# EAGLE design registers (EAGLE 5.11)

## Sheet 1 of 3
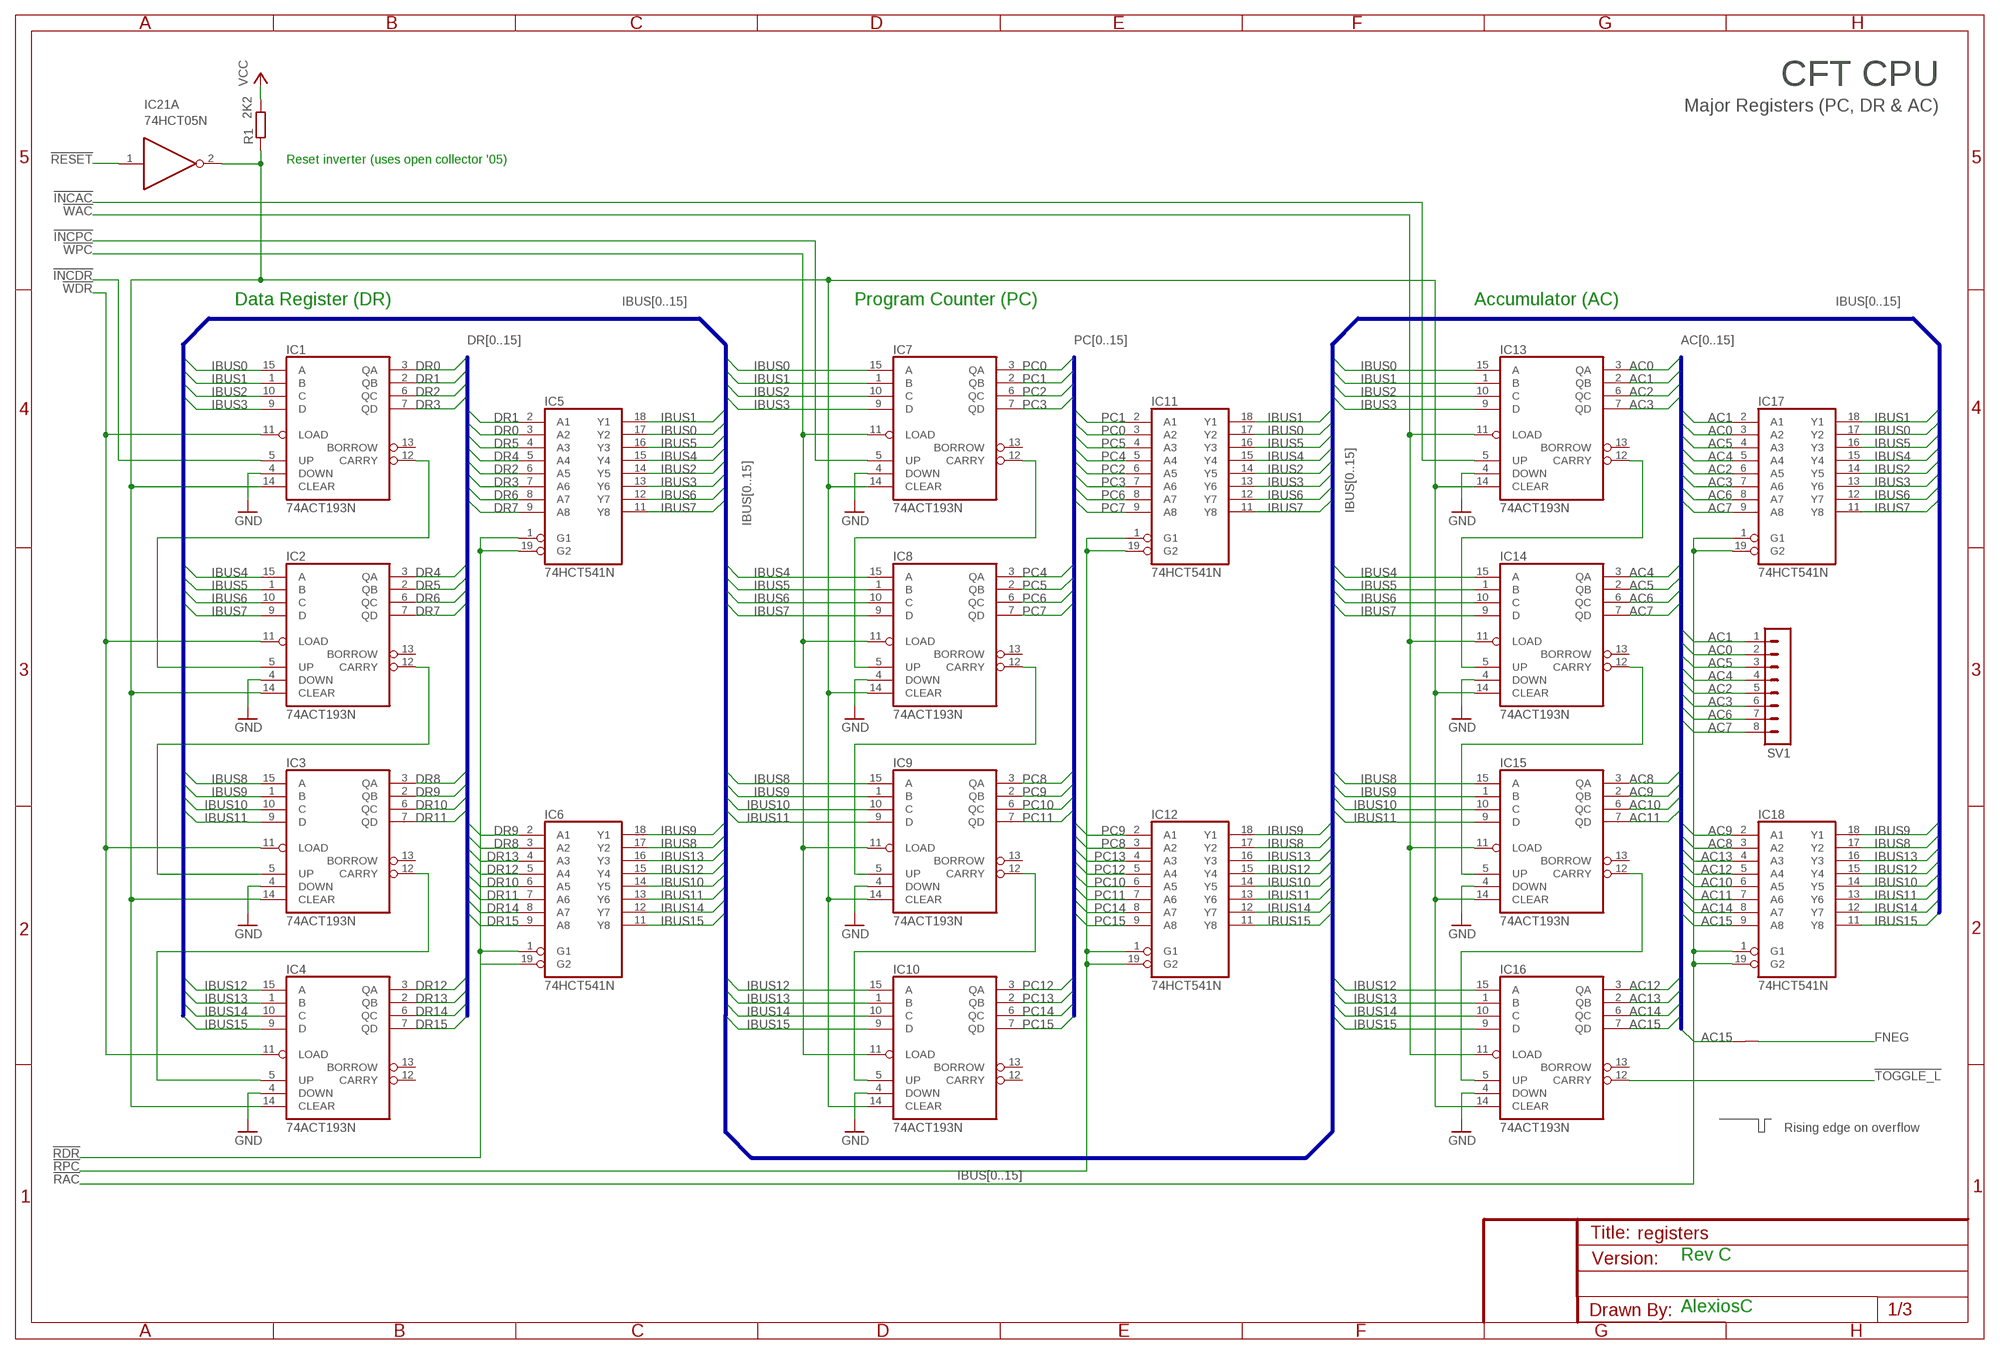
[diagram p0: schematic, sheet 1]

### Parts
IC1  74ACT193N  [DIL16]
IC2  74ACT193N  [DIL16]
IC3  74ACT193N  [DIL16]
IC4  74ACT193N  [DIL16]
IC5  74HCT541N  [DIL20]
IC6  74HCT541N  [DIL20]
IC7  74ACT193N  [DIL16]
IC8  74ACT193N  [DIL16]
IC9  74ACT193N  [DIL16]
IC10  74ACT193N  [DIL16]
IC11  74HCT541N  [DIL20]
IC12  74HCT541N  [DIL20]
IC13  74ACT193N  [DIL16]
IC14  74ACT193N  [DIL16]
IC15  74ACT193N  [DIL16]
IC16  74ACT193N  [DIL16]
IC17  74HCT541N  [DIL20]
IC18  74HCT541N  [DIL20]
IC21  74HCT05N  [DIL14]
J1  2SIG  [2SIG]
R1  2K2  R-EU_0204/7  [0204/7]
SV1  MA08-1  [MA08-1]

### Nets
!INCAC: IC13.5(UP) ; also sheet 3
!INCDR: IC1.5(UP) ; also sheet 3
!INCPC: IC7.5(UP) ; also sheet 3
!RAC: IC17.1(G1) IC17.19(G2) IC18.1(G1) IC18.19(G2) ; also sheet 3
!RDR: IC5.1(G1) IC5.19(G2) IC6.1(G1) IC6.19(G2) ; also sheet 3
!RESET: IC21.1(A:I) ; also sheet 3
!RPC: IC11.1(G1) IC11.19(G2) IC12.1(G1) IC12.19(G2) ; also sheet 3
!TOGGLE_L: IC16.12(CARRY) ; also sheet 2
!WAC: IC13.11(LOAD) IC14.11(LOAD) IC15.11(LOAD) IC16.11(LOAD) ; also sheet 3
!WDR: IC1.11(LOAD) IC2.11(LOAD) IC3.11(LOAD) IC4.11(LOAD) ; also sheet 3
!WPC: IC7.11(LOAD) IC8.11(LOAD) IC9.11(LOAD) IC10.11(LOAD) ; also sheet 3
AC0: IC13.3(QA) IC17.3(A2) SV1.2 ; also sheet 2
AC1: IC13.2(QB) IC17.2(A1) SV1.1 ; also sheet 2
AC2: IC13.6(QC) IC17.6(A5) SV1.5 ; also sheet 2
AC3: IC13.7(QD) IC17.7(A6) SV1.6 ; also sheet 2
AC4: IC14.3(QA) IC17.5(A4) SV1.4 ; also sheet 2
AC5: IC14.2(QB) IC17.4(A3) SV1.3 ; also sheet 2
AC6: IC14.6(QC) IC17.8(A7) SV1.7 ; also sheet 2
AC7: IC14.7(QD) IC17.9(A8) SV1.8 ; also sheet 2
AC8: IC15.3(QA) IC18.3(A2) ; also sheet 2
AC9: IC15.2(QB) IC18.2(A1) ; also sheet 2
AC10: IC15.6(QC) IC18.6(A5) ; also sheet 2
AC11: IC15.7(QD) IC18.7(A6) ; also sheet 2
AC12: IC16.3(QA) IC18.5(A4) ; also sheet 2
AC13: IC16.2(QB) IC18.4(A3) ; also sheet 2
AC14: IC16.6(QC) IC18.8(A7) ; also sheet 2
AC15: IC16.7(QD) IC18.9(A8) J1.P$1(B) ; also sheet 2
DR0: IC1.3(QA) IC5.3(A2)
DR1: IC1.2(QB) IC5.2(A1)
DR2: IC1.6(QC) IC5.6(A5)
DR3: IC1.7(QD) IC5.7(A6)
DR4: IC2.3(QA) IC5.5(A4)
DR5: IC2.2(QB) IC5.4(A3)
DR6: IC2.6(QC) IC5.8(A7)
DR7: IC2.7(QD) IC5.9(A8)
DR8: IC3.3(QA) IC6.3(A2)
DR9: IC3.2(QB) IC6.2(A1)
DR10: IC3.6(QC) IC6.6(A5)
DR11: IC3.7(QD) IC6.7(A6)
DR12: IC4.3(QA) IC6.5(A4)
DR13: IC4.2(QB) IC6.4(A3)
DR14: IC4.6(QC) IC6.8(A7)
DR15: IC4.7(QD) IC6.9(A8)
FNEG: J1.P$2(A) ; also sheet 3
GND [Power]: IC1.4(DOWN) IC2.4(DOWN) IC3.4(DOWN) IC4.4(DOWN) IC7.4(DOWN) IC8.4(DOWN) IC9.4(DOWN) IC10.4(DOWN) IC13.4(DOWN) IC14.4(DOWN) IC15.4(DOWN) IC16.4(DOWN) ; also sheet 2,3
IBUS0: IC1.15(A) IC5.17(Y2) IC7.15(A) IC11.17(Y2) IC13.15(A) IC17.17(Y2) ; also sheet 3
IBUS1: IC1.1(B) IC5.18(Y1) IC7.1(B) IC11.18(Y1) IC13.1(B) IC17.18(Y1) ; also sheet 3
IBUS2: IC1.10(C) IC5.14(Y5) IC7.10(C) IC11.14(Y5) IC13.10(C) IC17.14(Y5) ; also sheet 3
IBUS3: IC1.9(D) IC5.13(Y6) IC7.9(D) IC11.13(Y6) IC13.9(D) IC17.13(Y6) ; also sheet 3
IBUS4: IC2.15(A) IC5.15(Y4) IC8.15(A) IC11.15(Y4) IC14.15(A) IC17.15(Y4) ; also sheet 3
IBUS5: IC2.1(B) IC5.16(Y3) IC8.1(B) IC11.16(Y3) IC14.1(B) IC17.16(Y3) ; also sheet 3
IBUS6: IC2.10(C) IC5.12(Y7) IC8.10(C) IC11.12(Y7) IC14.10(C) IC17.12(Y7) ; also sheet 3
IBUS7: IC2.9(D) IC5.11(Y8) IC8.9(D) IC11.11(Y8) IC14.9(D) IC17.11(Y8) ; also sheet 3
IBUS8: IC3.15(A) IC6.17(Y2) IC9.15(A) IC12.17(Y2) IC15.15(A) IC18.17(Y2) ; also sheet 3
IBUS9: IC3.1(B) IC6.18(Y1) IC9.1(B) IC12.18(Y1) IC15.1(B) IC18.18(Y1) ; also sheet 3
IBUS10: IC3.10(C) IC6.14(Y5) IC9.10(C) IC12.14(Y5) IC15.10(C) IC18.14(Y5) ; also sheet 3
IBUS11: IC3.9(D) IC6.13(Y6) IC9.9(D) IC12.13(Y6) IC15.9(D) IC18.13(Y6) ; also sheet 3
IBUS12: IC4.15(A) IC6.15(Y4) IC10.15(A) IC12.15(Y4) IC16.15(A) IC18.15(Y4) ; also sheet 3
IBUS13: IC4.1(B) IC6.16(Y3) IC10.1(B) IC12.16(Y3) IC16.1(B) IC18.16(Y3) ; also sheet 3
IBUS14: IC4.10(C) IC6.12(Y7) IC10.10(C) IC12.12(Y7) IC16.10(C) IC18.12(Y7) ; also sheet 3
IBUS15: IC4.9(D) IC6.11(Y8) IC10.9(D) IC12.11(Y8) IC16.9(D) IC18.11(Y8) ; also sheet 3
N$25: IC1.12(CARRY) IC2.5(UP)
N$26: IC13.12(CARRY) IC14.5(UP)
N$27: IC14.12(CARRY) IC15.5(UP)
N$28: IC7.12(CARRY) IC8.5(UP)
N$29: IC2.12(CARRY) IC3.5(UP)
N$30: IC8.12(CARRY) IC9.5(UP)
N$31: IC3.12(CARRY) IC4.5(UP)
N$39: IC9.12(CARRY) IC10.5(UP)
N$77: IC15.12(CARRY) IC16.5(UP)
PC0: IC7.3(QA) IC11.3(A2)
PC1: IC7.2(QB) IC11.2(A1)
PC2: IC7.6(QC) IC11.6(A5)
PC3: IC7.7(QD) IC11.7(A6)
PC4: IC8.3(QA) IC11.5(A4)
PC5: IC8.2(QB) IC11.4(A3)
PC6: IC8.6(QC) IC11.8(A7)
PC7: IC8.7(QD) IC11.9(A8)
PC8: IC9.3(QA) IC12.3(A2)
PC9: IC9.2(QB) IC12.2(A1)
PC10: IC9.6(QC) IC12.6(A5) ; also sheet 3
PC11: IC9.7(QD) IC12.7(A6) ; also sheet 3
PC12: IC10.3(QA) IC12.5(A4) ; also sheet 3
PC13: IC10.2(QB) IC12.4(A3) ; also sheet 3
PC14: IC10.6(QC) IC12.8(A7) ; also sheet 3
PC15: IC10.7(QD) IC12.9(A8) ; also sheet 3
RESET: IC1.14(CLEAR) IC2.14(CLEAR) IC3.14(CLEAR) IC4.14(CLEAR) IC7.14(CLEAR) IC8.14(CLEAR) IC9.14(CLEAR) IC10.14(CLEAR) IC13.14(CLEAR) IC14.14(CLEAR) IC15.14(CLEAR) IC16.14(CLEAR) IC21.2(A:O) R1.1
VCC [Power]: R1.2 ; also sheet 2,3
Unconnected: IC1.13(BORROW) IC2.13(BORROW) IC3.13(BORROW) IC4.12(CARRY) IC4.13(BORROW) IC7.13(BORROW) IC8.13(BORROW) IC9.13(BORROW) IC10.12(CARRY) IC10.13(BORROW) IC13.13(BORROW) IC14.13(BORROW) IC15.13(BORROW) IC16.13(BORROW)

### Buses
IBUS[0..15]
DR[0..15]
PC[0..15]
AC[0..15]

### Notes on the sheet
- CFT CPU
- Major Registers (PC, DR & AC)
- Reset inverter (uses open collector '05)
- Data Register (DR) | Program Counter (PC) | Accumulator (AC)
- Rising edge on overflow
- Rev C
- AlexiosC

## Sheet 2 of 3
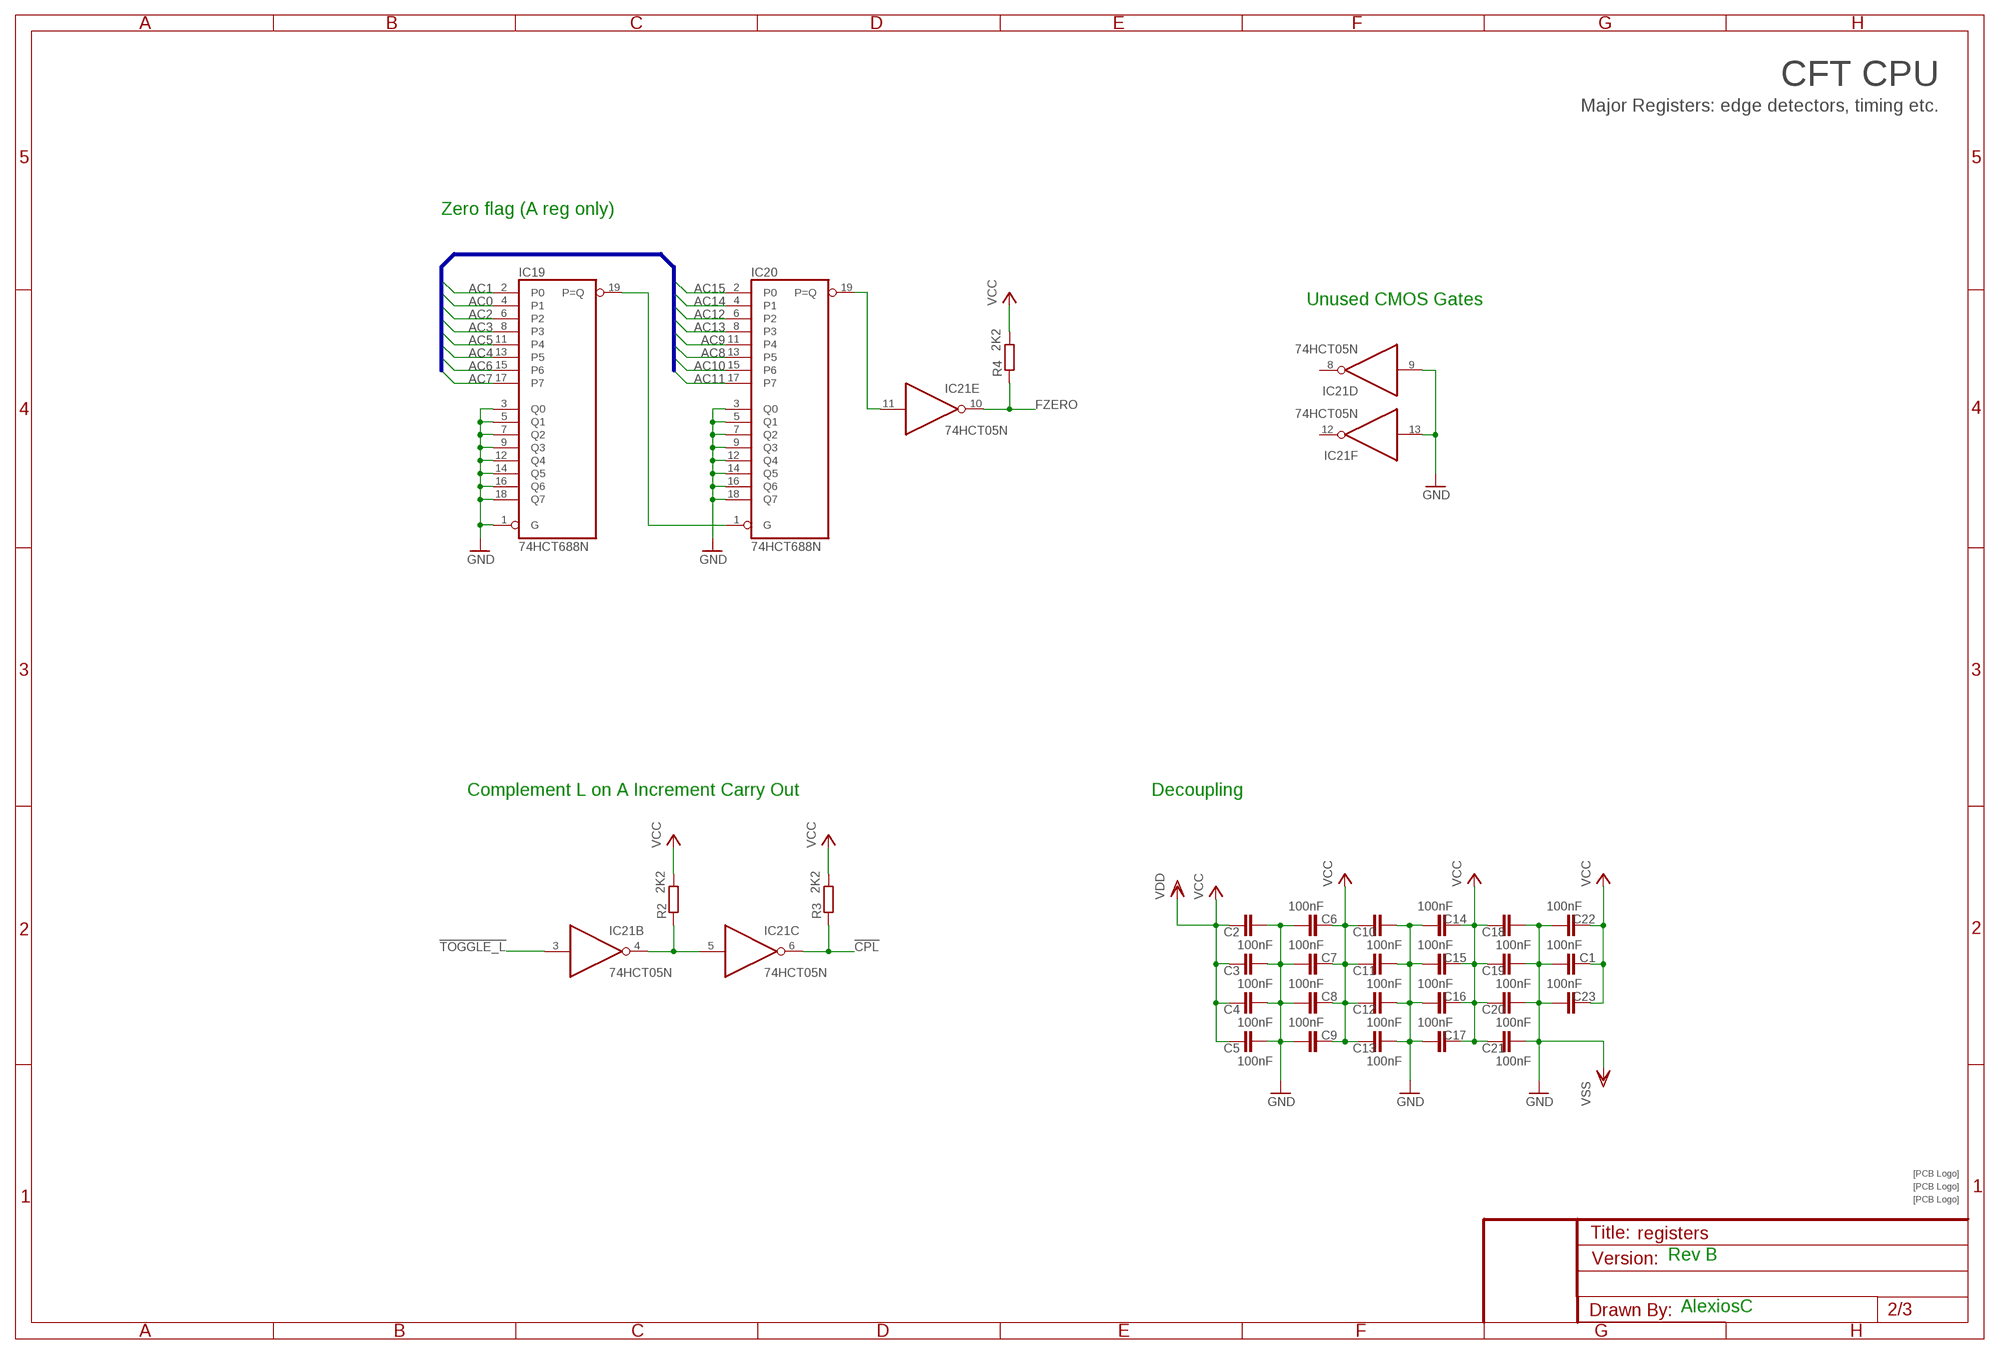
[diagram p1: schematic, sheet 2]

### Parts
C1  100nF  C-EU025-025X050  [C025-025X050]
C2  100nF  C-EU025-025X050  [C025-025X050]
C3  100nF  C-EU025-025X050  [C025-025X050]
C4  100nF  C-EU025-025X050  [C025-025X050]
C5  100nF  C-EU025-025X050  [C025-025X050]
C6  100nF  C-EU025-025X050  [C025-025X050]
C7  100nF  C-EU025-025X050  [C025-025X050]
C8  100nF  C-EU025-025X050  [C025-025X050]
C9  100nF  C-EU025-025X050  [C025-025X050]
C10  100nF  C-EU025-025X050  [C025-025X050]
C11  100nF  C-EU025-025X050  [C025-025X050]
C12  100nF  C-EU025-025X050  [C025-025X050]
C13  100nF  C-EU025-025X050  [C025-025X050]
C14  100nF  C-EU025-025X050  [C025-025X050]
C15  100nF  C-EU025-025X050  [C025-025X050]
C16  100nF  C-EU025-025X050  [C025-025X050]
C17  100nF  C-EU025-025X050  [C025-025X050]
C18  100nF  C-EU025-025X050  [C025-025X050]
C19  100nF  C-EU025-025X050  [C025-025X050]
C20  100nF  C-EU025-025X050  [C025-025X050]
C21  100nF  C-EU025-025X050  [C025-025X050]
C22  100nF  C-EU025-025X050  [C025-025X050]
C23  100nF  C-EU025-025X050  [C025-025X050]
IC19  74HCT688N  [DIL20]
IC20  74HCT688N  [DIL20]
R2  2K2  R-EU_0204/7  [0204/7]
R3  2K2  R-EU_0204/7  [0204/7]
R4  2K2  R-EU_0204/7  [0204/7]
U$4  SIGNATUREPLANE  [SIGNATURE_PLANE]
U$5  SIGNATUREPLANE  [SIGNATURE_PLANE]
U$6  SIGNATURESILK  [SIGNATURE]

### Nets
!CPL: IC21.6(C:O) R3.1 ; also sheet 3
!TOGGLE_L: IC21.3(B:I) ; also sheet 1
AC0: IC19.4(P1) ; also sheet 1
AC1: IC19.2(P0) ; also sheet 1
AC2: IC19.6(P2) ; also sheet 1
AC3: IC19.8(P3) ; also sheet 1
AC4: IC19.13(P5) ; also sheet 1
AC5: IC19.11(P4) ; also sheet 1
AC6: IC19.15(P6) ; also sheet 1
AC7: IC19.17(P7) ; also sheet 1
AC8: IC20.13(P5) ; also sheet 1
AC9: IC20.11(P4) ; also sheet 1
AC10: IC20.15(P6) ; also sheet 1
AC11: IC20.17(P7) ; also sheet 1
AC12: IC20.6(P2) ; also sheet 1
AC13: IC20.8(P3) ; also sheet 1
AC14: IC20.4(P1) ; also sheet 1
AC15: IC20.2(P0) ; also sheet 1
FZERO: IC21.10(E:O) R4.1 ; also sheet 3
GND [Power]: C1.1 C2.1 C3.1 C4.1 C5.1 C6.1 C7.1 C8.1 C9.1 C10.1 C11.1 C12.1 C13.1 C14.1 C15.1 C16.1 C17.1 C18.1 C19.1 C20.1 C21.1 C22.1 C23.1 IC19.1(G) IC19.3(Q0) IC19.5(Q1) IC19.7(Q2) IC19.9(Q3) IC19.12(Q4) IC19.14(Q5) IC19.16(Q6) IC19.18(Q7) IC20.3(Q0) IC20.5(Q1) IC20.7(Q2) IC20.9(Q3) IC20.12(Q4) IC20.14(Q5) IC20.16(Q6) IC20.18(Q7) IC21.9(D:I) IC21.13(F:I) ; supply symbol labelled VSS ; also sheet 1,3
N$1: IC21.4(B:O) IC21.5(C:I) R2.1
N$2: IC19.19(P=Q) IC20.1(G)
N$16: IC20.19(P=Q) IC21.11(E:I)
VCC [Power]: C1.2 C2.2 C3.2 C4.2 C5.2 C6.2 C7.2 C8.2 C9.2 C10.2 C11.2 C12.2 C13.2 C14.2 C15.2 C16.2 C17.2 C18.2 C19.2 C20.2 C21.2 C22.2 C23.2 R2.2 R3.2 R4.2 ; supply symbol labelled VDD ; also sheet 1,3
Unconnected: IC21.8(D:O) IC21.12(F:O)

### Buses
AC[0..15]

### Notes on the sheet
- CFT CPU
- Major Registers: edge detectors, timing etc.
- Zero flag (A reg only)
- Unused CMOS Gates
- Complement L on A Increment Carry Out | Decoupling
- Rev B
- AlexiosC

## Sheet 3 of 3
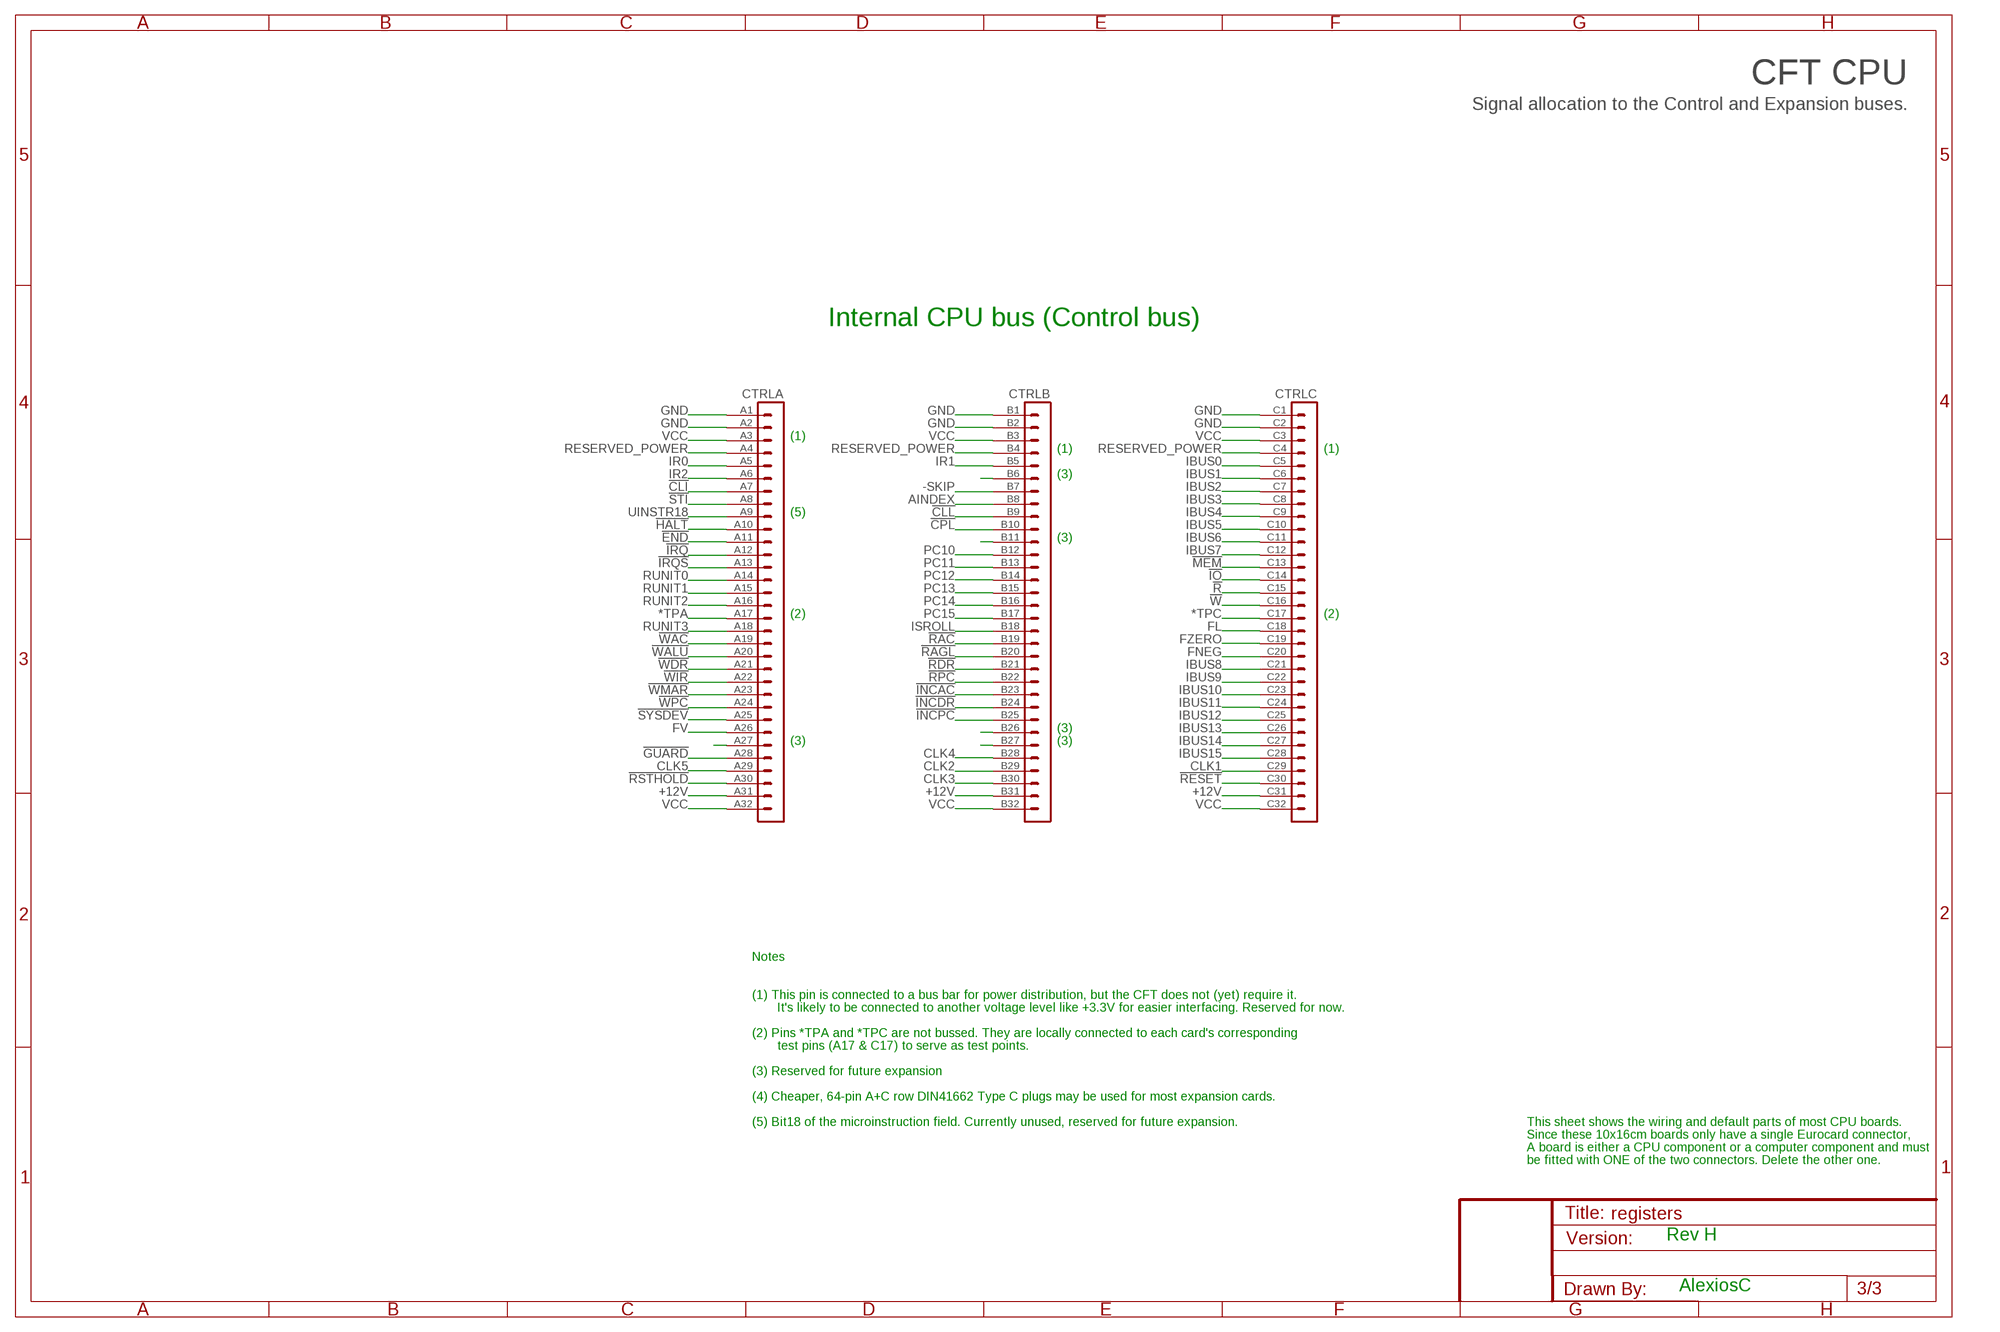
[diagram p2: schematic, sheet 3]

### Parts
CTRL  VG96-3B  [VG96B]

### Nets
!CLI: CTRL.A7
!CLL: CTRL.B9
!CPL: CTRL.B10 ; also sheet 2
!END: CTRL.A11
!GUARD: CTRL.A28
!HALT: CTRL.A10
!INCAC: CTRL.B23 ; also sheet 1
!INCDR: CTRL.B24 ; also sheet 1
!INCPC: CTRL.B25 ; also sheet 1
!IO: CTRL.C14
!IRQ: CTRL.A12
!IRQS: CTRL.A13
!MEM: CTRL.C13
!R: CTRL.C15
!RAC: CTRL.B19 ; also sheet 1
!RAGL: CTRL.B20
!RDR: CTRL.B21 ; also sheet 1
!RESET: CTRL.C30 ; also sheet 1
!RPC: CTRL.B22 ; also sheet 1
!RSTHOLD: CTRL.A30
!STI: CTRL.A8
!SYSDEV: CTRL.A25
!W: CTRL.C16
!WAC: CTRL.A19 ; also sheet 1
!WALU: CTRL.A20
!WDR: CTRL.A21 ; also sheet 1
!WIR: CTRL.A22
!WMAR: CTRL.A23
!WPC: CTRL.A24 ; also sheet 1
*TPA: CTRL.A17
*TPC: CTRL.C17
+12V [12V]: CTRL.A31 CTRL.B31 CTRL.C31
-SKIP: CTRL.B7
AINDEX: CTRL.B8
CLK1: CTRL.C29
CLK2: CTRL.B29
CLK3: CTRL.B30
CLK4: CTRL.B28
CLK5: CTRL.A29
FL: CTRL.C18
FNEG: CTRL.C20 ; also sheet 1
FV: CTRL.A26
FZERO: CTRL.C19 ; also sheet 2
GND [Power]: CTRL.A1 CTRL.A2 CTRL.B1 CTRL.B2 CTRL.C1 CTRL.C2 ; also sheet 1,2
IBUS0: CTRL.C5 ; also sheet 1
IBUS1: CTRL.C6 ; also sheet 1
IBUS2: CTRL.C7 ; also sheet 1
IBUS3: CTRL.C8 ; also sheet 1
IBUS4: CTRL.C9 ; also sheet 1
IBUS5: CTRL.C10 ; also sheet 1
IBUS6: CTRL.C11 ; also sheet 1
IBUS7: CTRL.C12 ; also sheet 1
IBUS8: CTRL.C21 ; also sheet 1
IBUS9: CTRL.C22 ; also sheet 1
IBUS10: CTRL.C23 ; also sheet 1
IBUS11: CTRL.C24 ; also sheet 1
IBUS12: CTRL.C25 ; also sheet 1
IBUS13: CTRL.C26 ; also sheet 1
IBUS14: CTRL.C27 ; also sheet 1
IBUS15: CTRL.C28 ; also sheet 1
IR0: CTRL.A5
IR1: CTRL.B5
IR2: CTRL.A6
ISROLL: CTRL.B18
N$13: CTRL.B27
N$21: CTRL.B6
N$22: CTRL.A27
N$23: CTRL.B26
N$47: CTRL.B11
PC10: CTRL.B12 ; also sheet 1
PC11: CTRL.B13 ; also sheet 1
PC12: CTRL.B14 ; also sheet 1
PC13: CTRL.B15 ; also sheet 1
PC14: CTRL.B16 ; also sheet 1
PC15: CTRL.B17 ; also sheet 1
RESERVED_POWER: CTRL.A4 CTRL.B4 CTRL.C4
RUNIT0: CTRL.A14
RUNIT1: CTRL.A15
RUNIT2: CTRL.A16
RUNIT3: CTRL.A18
UINSTR18: CTRL.A9
VCC [Power]: CTRL.A3 CTRL.A32 CTRL.B3 CTRL.B32 CTRL.C3 CTRL.C32 ; also sheet 1,2

### Notes on the sheet
- CFT CPU
- Signal allocation to the Control and Expansion buses.
- Internal CPU bus (Control bus)
- (1)
- (1) | (1)
- (3)
- (5)
- (3)
- (2) | (2)
- (3)
- (3) | (3)
- Notes
- (1) This pin is connected to a bus bar for power distribution, but the CFT does not (yet) require it.
- It's likely to be connected to another voltage level like +3.3V for easier interfacing. Reserved for now.
- (2) Pins *TPA and *TPC are not bussed. They are locally connected to each card's corresponding
- test pins (A17 & C17) to serve as test points.
- (3) Reserved for future expansion
- (4) Cheaper, 64-pin A+C row DIN41662 Type C plugs may be used for most expansion cards.
- (5) Bit18 of the microinstruction field. Currently unused, reserved for future expansion. | This sheet shows the wiring and default parts of most CPU boards.
- Since these 10x16cm boards only have a single Eurocard connector,
- A board is either a CPU component or a computer component and must
- be fitted with ONE of the two connectors. Delete the other one.
- Rev H
- AlexiosC

## Power pins joined to a net without a drawn wire
GND: IC1.8(GND) IC2.8(GND) IC3.8(GND) IC4.8(GND) IC5.10(GND) IC6.10(GND) IC7.8(GND) IC8.8(GND) IC9.8(GND) IC10.8(GND) IC11.10(GND) IC12.10(GND) IC13.8(GND) IC14.8(GND) IC15.8(GND) IC16.8(GND) IC17.10(GND) IC18.10(GND) IC19.10(GND) IC20.10(GND) IC21.7(P:GND)
VCC: IC1.16(VCC) IC2.16(VCC) IC3.16(VCC) IC4.16(VCC) IC5.20(VCC) IC6.20(VCC) IC7.16(VCC) IC8.16(VCC) IC9.16(VCC) IC10.16(VCC) IC11.20(VCC) IC12.20(VCC) IC13.16(VCC) IC14.16(VCC) IC15.16(VCC) IC16.16(VCC) IC17.20(VCC) IC18.20(VCC) IC19.20(VCC) IC20.20(VCC) IC21.14(P:VCC)

## Library data of the parts
C1-C23 = rcl:C-EU: CAPACITOR, European symbol
CTRL = 19inch:VG96-3: PCB EUROCARD, 96-pin type C/ABC, 2.54 mm
IC1-IC4 IC7-IC10 IC13-IC16 = alexios:74*193: Presettable Synchronous Binary Up/Down Counter Up/down 4-bit binary counter with load and clear inputs, and borrow and carry outputs. Farnell description: <http://uk.farnell.com/nxp/74hct193n/ic-74hct-cmos-74hct193-dip16-5v/dp/382218> Order Code: 382218 Manufacturer Part No: 74HCT193N RoHS : Yes Description: IC, 74HCT CMOS, 74HCT193, DIP16, 5V Counter Type:Binary Clock Frequency:47MHz Count Maximum:15 Supply Voltage Range:4.5V to 5.5V Logic Case Style:DIP No. of Pins:16 Operating Temperature Range:-40°C to +125°C Base Number:74 Clock Frequency Max:43MHz Count Max:16 Counter Measuring Functions:Presettable Synchronous Binary Up / Down Counter Device Marking:74HCT193 IC Generic Number:74HCT193 Logic Function Number:193 Logic IC Base Number:74193 Logic IC Family:HCT Logic IC Function:Presettable Synchronous 4bit Binary Up/Down Counter No. of Gates:1 No. of Inputs:4 Operating Temperature Max:125°C Operating Temperature Min:-40°C Package / Case:DIP Supply Voltage:5V Supply Voltage Max:5.5V Supply Voltage Min:4.5V Termination Type:Through Hole
IC5 IC6 IC11 IC12 IC17 IC18 = 74xx-eu:74*541: Octal BUFFER and LINE DRIVER, 3-state
IC19 IC20 = 74xx-eu:74*688: 8-bit MAGNITUDE/IDENTITY COMPARATOR, totem pole
IC21 = 74xx-eu:74*05: Hex INVERTER, open collector
J1 = alexios:2SIG: Connect two signals together
R1-R4 = resistor:R-EU_: RESISTOR, European symbol
SV1 = con-lstb:MA08-1: PIN HEADER; OC_FARNELL: unknown; OC_NEWARK: unknown
U$4-U$6 = alexios:SIGNATURE: Soup signature

## Net classes
0 default: width 0.305 mm, clearance 0.305 mm
1 Power: width 0.914 mm, clearance 0.254 mm
2 12V: width 0.635 mm, clearance 0.635 mm

## Board
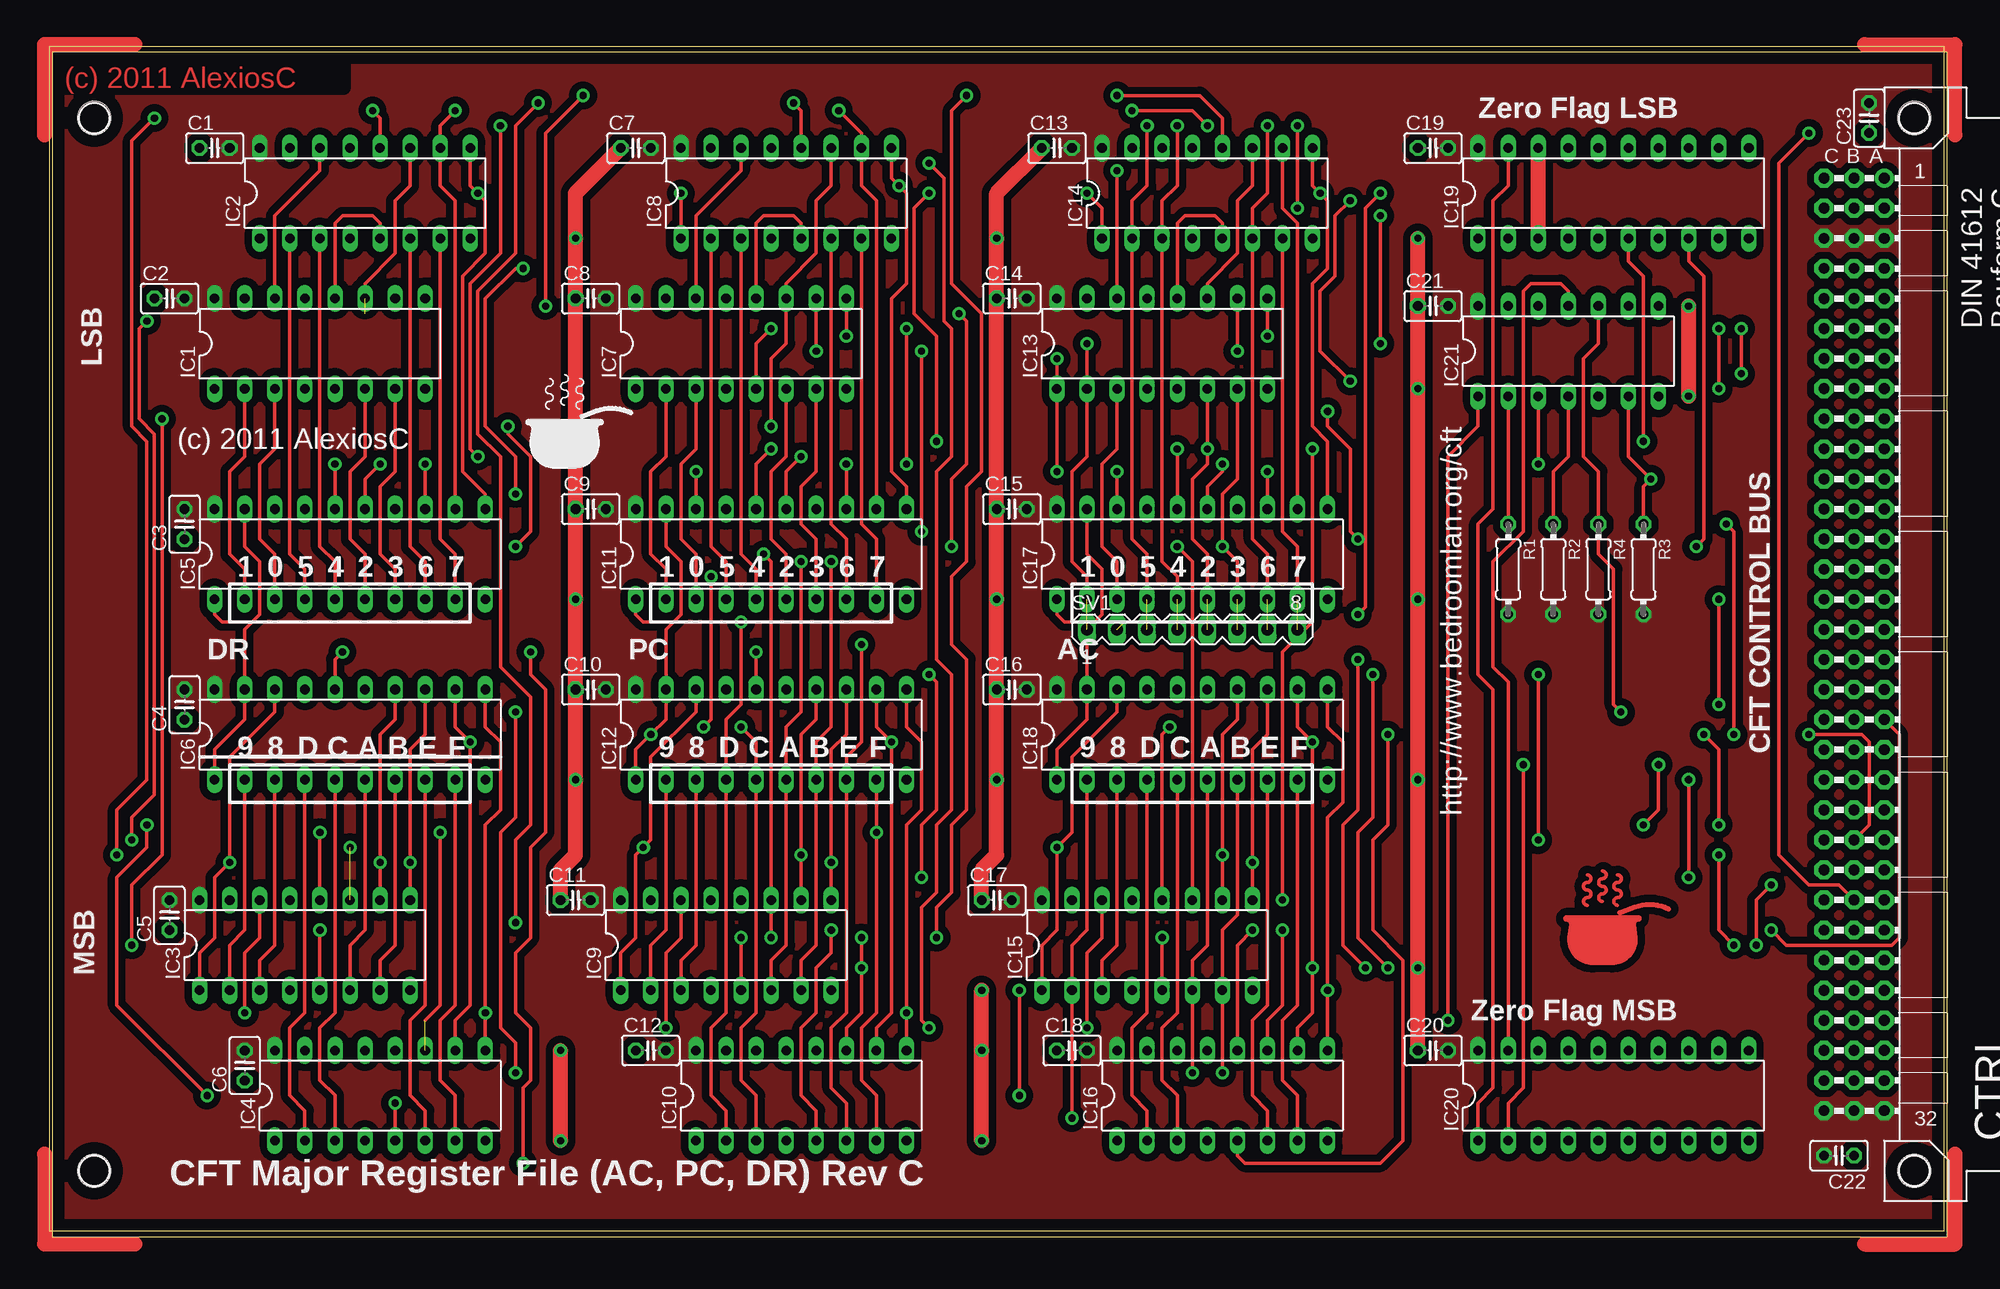
[diagram p3: board, top side]
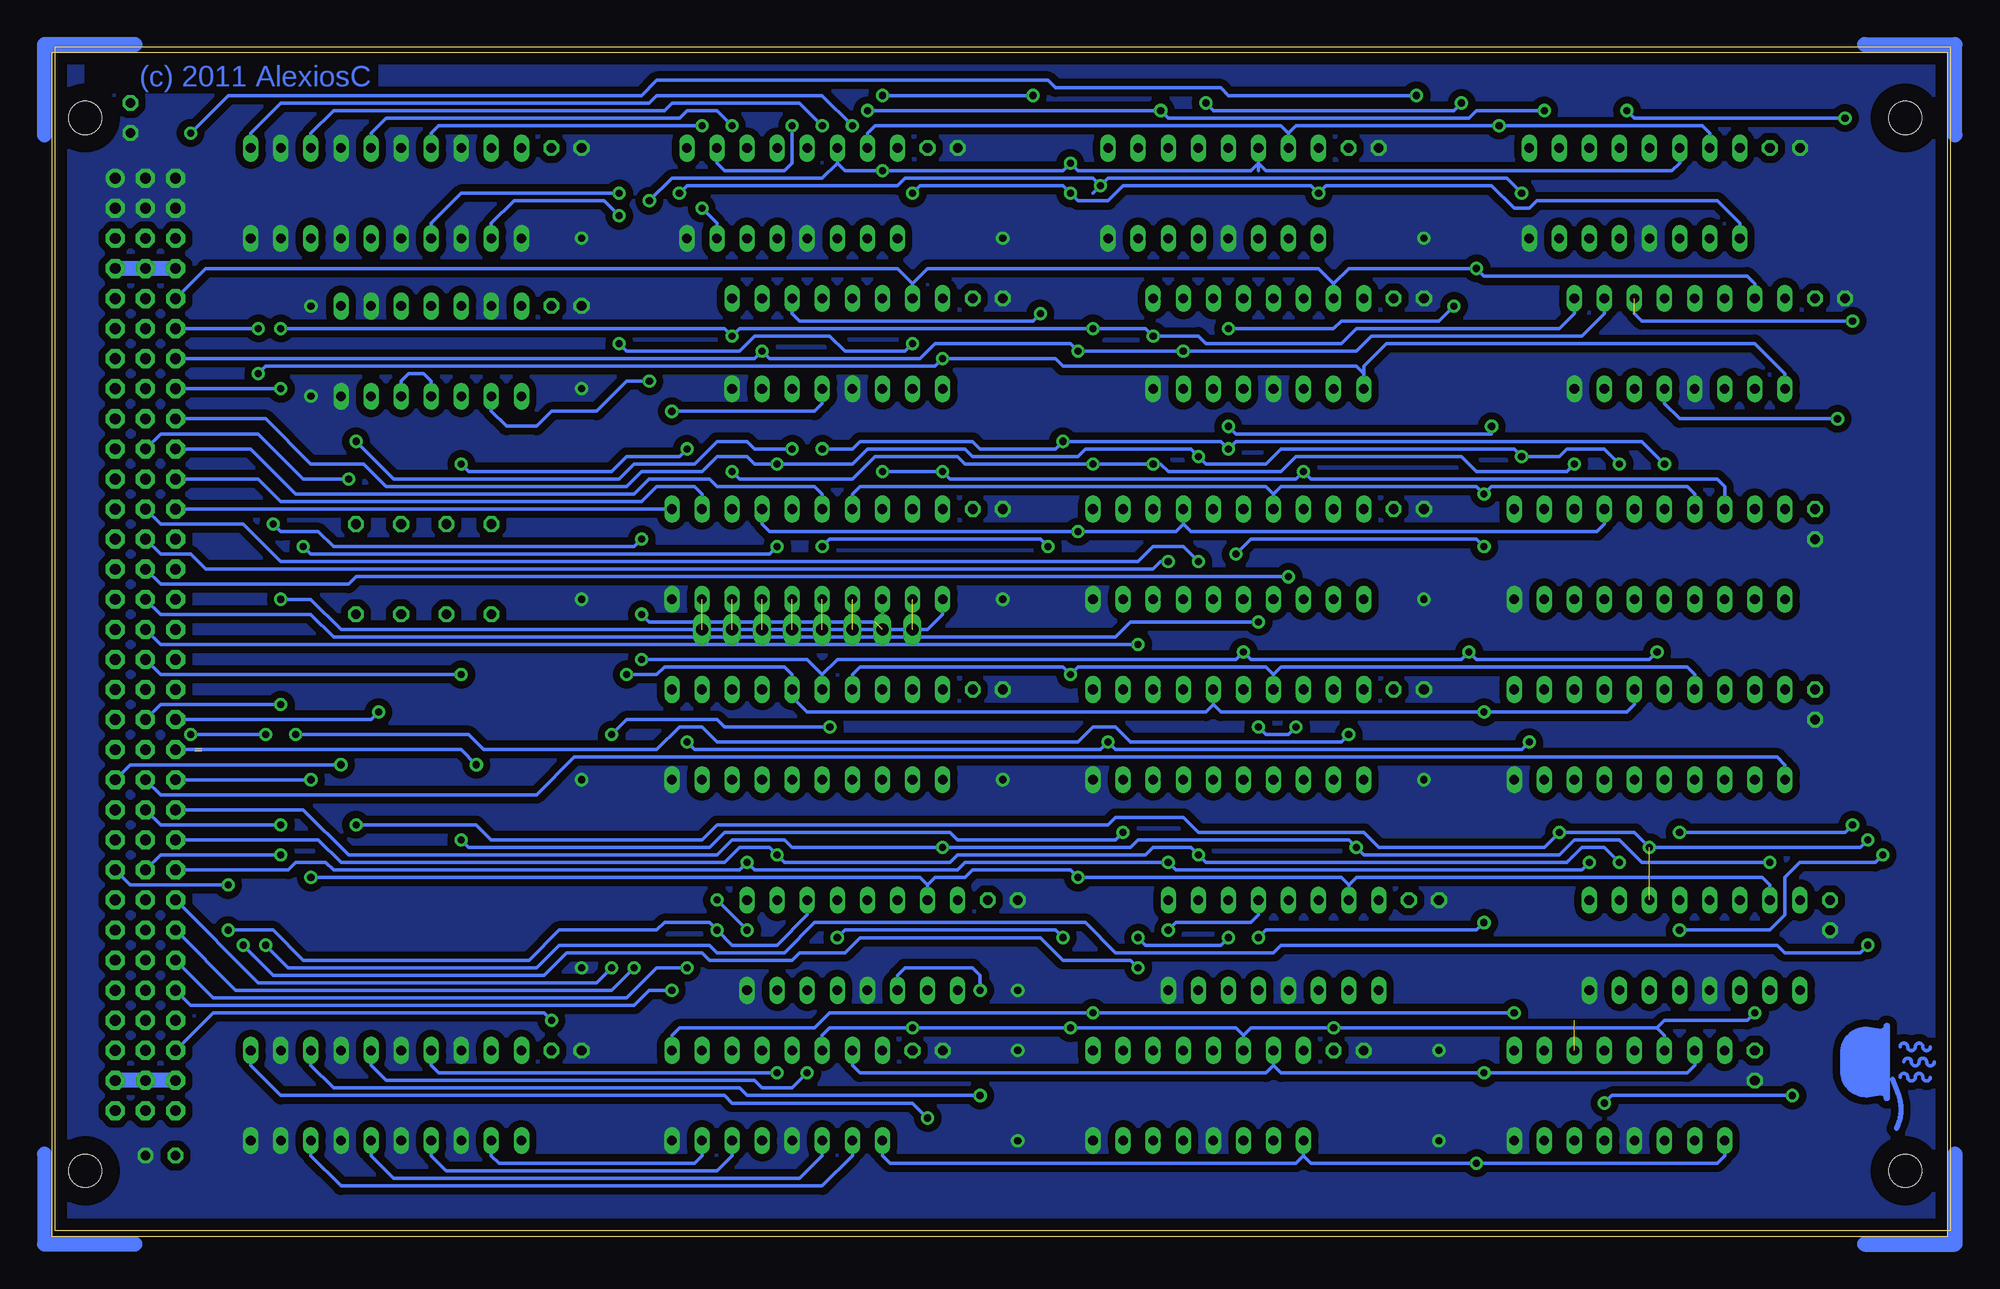
[diagram p4: board, bottom side, seen from below]

Size 160 x 100 mm. Coordinates in mm from the lower left corner, seen from the top.
Outline: 0,0 160,0 160,100 0,100 0,0
Copper layers (1*16): Top 0.035mm / dielectric 1.5mm / Bottom 0.035mm
Design rules "cft-olimex-10mil": minimum track width 10mil, minimum drill 24mil, track to track 10mil, track to pad 10mil, pad to pad 10mil, via to via 10mil, smd to smd 10mil, copper to edge 40mil, drill to drill 10mil, minimum pad ring 10mil, minimum via ring 10mil, stop-mask expansion 0mil, vias tented up to drill 10mil, thermal gap 10mil

### Footprints (pad centres in the part's own frame; a part is rotated, then mirrored left to right if it is on the bottom)
C025-025X050 = drill 0.813 octagon: 1 -1.27,0; 2 1.27,0
VG96B = drill 0.914 pad 1.6 round: A1 154.94,39.37 | drill 0.914 pad 1.6 octagon: A2 154.94,36.83; A3 154.94,34.29; A4 154.94,31.75; A5 154.94,29.21; A6 154.94,26.67; A7 154.94,24.13; A8 154.94,21.59; A9 154.94,19.05; A10 154.94,16.51; A11 154.94,13.97; A12 154.94,11.43; A13 154.94,8.89; A14 154.94,6.35; A15 154.94,3.81; A16 154.94,1.27; A17 154.94,-1.27; A18 154.94,-3.81; A19 154.94,-6.35; A20 154.94,-8.89; A21 154.94,-11.43; A22 154.94,-13.97; A23 154.94,-16.51; A24 154.94,-19.05; A25 154.94,-21.59; A26 154.94,-24.13; A27 154.94,-26.67; A28 154.94,-29.21; A29 154.94,-31.75; A30 154.94,-34.29; A31 154.94,-36.83; A32 154.94,-39.37; B1 152.4,39.37; B2 152.4,36.83; B3 152.4,34.29; B4 152.4,31.75; B5 152.4,29.21; B6 152.4,26.67; B7 152.4,24.13; B8 152.4,21.59; B9 152.4,19.05; B10 152.4,16.51; B11 152.4,13.97; B12 152.4,11.43; B13 152.4,8.89; B14 152.4,6.35; B15 152.4,3.81; B16 152.4,1.27; B17 152.4,-1.27; B18 152.4,-3.81; B19 152.4,-6.35; B20 152.4,-8.89; B21 152.4,-11.43; B22 152.4,-13.97; B23 152.4,-16.51; B24 152.4,-19.05; B25 152.4,-21.59; B26 152.4,-24.13; B27 152.4,-26.67; B28 152.4,-29.21; B29 152.4,-31.75; B30 152.4,-34.29; B31 152.4,-36.83; B32 152.4,-39.37; C1 149.86,39.37; C2 149.86,36.83; C3 149.86,34.29; C4 149.86,31.75; C5 149.86,29.21; C6 149.86,26.67; C7 149.86,24.13; C8 149.86,21.59; C9 149.86,19.05; C10 149.86,16.51; C11 149.86,13.97; C12 149.86,11.43; C13 149.86,8.89; C14 149.86,6.35; C15 149.86,3.81; C16 149.86,1.27; C17 149.86,-1.27; C18 149.86,-3.81; C19 149.86,-6.35; C20 149.86,-8.89; C21 149.86,-11.43; C22 149.86,-13.97; C23 149.86,-16.51; C24 149.86,-19.05; C25 149.86,-21.59; C26 149.86,-24.13; C27 149.86,-26.67; C28 149.86,-29.21; C29 149.86,-31.75; C30 149.86,-34.29; C31 149.86,-36.83; C32 149.86,-39.37 | hole 2.794: 157.48,44.45; 157.48,-44.45; 3.81,44.45; 3.81,-44.45
DIL16 = drill 0.813 long: 1 -8.89,-3.81; 2 -6.35,-3.81; 3 -3.81,-3.81; 4 -1.27,-3.81; 5 1.27,-3.81; 6 3.81,-3.81; 7 6.35,-3.81; 8 8.89,-3.81; 9 8.89,3.81; 10 6.35,3.81; 11 3.81,3.81; 12 1.27,3.81; 13 -1.27,3.81; 14 -3.81,3.81; 15 -6.35,3.81; 16 -8.89,3.81
DIL20 = drill 0.813 long: 1 -11.43,-3.81; 2 -8.89,-3.81; 3 -6.35,-3.81; 4 -3.81,-3.81; 5 -1.27,-3.81; 6 1.27,-3.81; 7 3.81,-3.81; 8 6.35,-3.81; 9 8.89,-3.81; 10 11.43,-3.81; 11 11.43,3.81; 12 8.89,3.81; 13 6.35,3.81; 14 3.81,3.81; 15 1.27,3.81; 16 -1.27,3.81; 17 -3.81,3.81; 18 -6.35,3.81; 19 -8.89,3.81; 20 -11.43,3.81
DIL14 = drill 0.813 long: 1 -7.62,-3.81; 2 -5.08,-3.81; 3 -2.54,-3.81; 4 0,-3.81; 5 2.54,-3.81; 6 5.08,-3.81; 7 7.62,-3.81; 8 7.62,3.81; 9 5.08,3.81; 10 2.54,3.81; 11 0,3.81; 12 -2.54,3.81; 13 -5.08,3.81; 14 -7.62,3.81
2SIG = smd 0.61 x 0.305: P$1 0,0; P$2 0,0
0204/7 = drill 0.813 octagon: 1 -3.81,0; 2 3.81,0
MA08-1 = drill 1.016 long: 1 -8.89,0; 2 -6.35,0; 3 -3.81,0; 4 -1.27,0; 5 1.27,0; 6 3.81,0; 7 6.35,0; 8 8.89,0

### Placement (x,y rotation side)
C1  13.97,91.44 0 top
C2  10.16,78.74 0 top
C3  11.43,59.69 90 top
C4  11.43,44.45 90 top
C5  10.16,26.67 90 top
C6  16.51,13.97 90 top
C7  49.53,91.44 0 top
C8  45.72,78.74 0 top
C9  45.72,60.96 0 top
C10  45.72,45.72 0 top
C11  44.45,27.94 0 top
C12  50.8,15.24 0 top
C13  85.09,91.44 0 top
C14  81.28,78.74 0 top
C15  81.28,60.96 0 top
C16  81.28,45.72 0 top
C17  80.01,27.94 0 top
C18  86.36,15.24 0 top
C19  116.84,91.44 0 top
C20  116.84,15.24 0 top
C21  116.84,78.11 0 top
C22  151.13,6.35 180 top
C23  153.67,93.98 90 top
CTRL  0,49.53 0 top
IC1  22.86,74.93 0 top
IC2  26.67,87.63 0 top
IC3  21.59,24.13 0 top
IC4  27.94,11.43 0 top
IC5  25.4,57.15 0 top
IC6  25.4,41.91 0 top
IC7  58.42,74.93 0 top
IC8  62.23,87.63 0 top
IC9  57.15,24.13 0 top
IC10  63.5,11.43 0 top
IC11  60.96,57.15 0 top
IC12  60.96,41.91 0 top
IC13  93.98,74.93 0 top
IC14  97.79,87.63 0 top
IC15  92.71,24.13 0 top
IC16  99.06,11.43 0 top
IC17  96.52,57.15 0 top
IC18  96.52,41.91 0 top
IC19  132.08,87.63 0 top
IC20  132.08,11.43 0 top
IC21  128.27,74.3 0 top
J1  147.96,40.64 0 bottom
R1  123.19,55.88 270 top
R2  127,55.88 270 top
R3  134.62,55.88 270 top
R4  130.81,55.88 270 top
SV1  96.52,50.8 0 top
U$4  128.27,22.23 0 top
U$5  9.53,17.14 270 bottom
U$6  40.64,64.14 0 top

### Tracks (layer width: path | path; a pad name or v marks a point on that pad's centre or on a via)
!CPL  (via drill 0.6)
  Top 0.305: IC21.6 133.35,65.41 v135.25,63.5 134.62,62.87 R3.1
  Bottom 0.305: CTRL.B10 151.13,67.31 142.88,67.31 139.06,63.5 v135.25,63.5
!INCAC  (via drill 0.6)
  Top 0.305: CTRL.B23 153.67,34.29 153.67,41.27 153.03,41.91 v148.59,41.91 | v107.95,69.22 107.95,67.94 109.86,66.04 109.86,59.05 v110.49,58.42 | v141.6,59.69 142.24,59.05 v142.24,41.91
  Bottom 0.305: IC13.5 95.25,69.85 95.89,69.22 v107.95,69.22 | v110.49,58.42 111.12,57.78 136.53,57.78 137.79,59.05 140.97,59.05 v141.6,59.69 | v142.24,41.91 v148.59,41.91
!INCDR  (via drill 0.6)
  Top 0.305: v142.24,24.13 140.97,25.4 v140.97,31.75 | v6.99,24.13 6.99,29.21 9.53,31.75 v9.53,68.58
  Bottom 0.305: CTRL.B24 151.13,31.75 v140.97,31.75 | v142.24,24.13 140.34,22.23 119.38,22.23 117.47,24.13 104.78,24.13 104.14,23.5 98.42,23.5 95.89,26.04 73.03,26.04 70.48,23.5 57.15,23.5 56.52,24.13 14.61,24.13 13.97,23.5 7.62,23.5 v6.99,24.13 | v9.53,68.58 22.86,68.58 24.13,69.85 IC1.5
!INCPC  (via drill 0.6)
  Top 0.305: IC7.5 59.69,74.93 v60.96,76.2 | v41.91,78.11 41.91,92.71 v45.09,95.89 | v148.59,92.71 146.05,90.17 146.05,31.75 148.59,29.21 151.13,29.21 CTRL.B25
  Bottom 0.305: v60.96,76.2 52.07,76.2 51.44,76.83 43.18,76.83 v41.91,78.11 | v45.09,95.89 60.96,95.89 61.59,96.52 75.56,96.52 76.2,97.16 109.22,97.16 110.49,95.89 145.41,95.89 v148.59,92.71
!RAC  (via drill 0.6)
  Top 0.305: IC17.19 87.63,57.15 88.9,55.88 88.9,52.07 88.27,51.44 | IC18.1 85.09,40.64 87.63,43.18 IC18.19 87.63,50.8 88.27,51.44 | 88.27,51.44 85.72,51.44 85.09,52.07 IC17.1 | v140.97,53.34 v140.97,44.45
  Bottom 0.305: IC17.1 85.09,52.07 86.36,50.8 135.89,50.8 138.43,53.34 v140.97,53.34 | v140.97,44.45 151.13,44.45 CTRL.B19
!RDR
  Top 0.305: IC5.19 16.51,57.78 17.78,56.52 17.78,52.07 17.14,51.44 | 17.14,51.44 14.61,51.44 13.97,52.07 IC5.1 | IC6.1 13.97,40.64 16.51,43.18 IC6.19 16.51,50.8 17.14,51.44
  Bottom 0.305: IC6.1 13.97,39.37 14.61,40.01 116.2,40.01 119.38,36.83 151.13,36.83 CTRL.B21
!RESET  (via drill 0.6)
  Top 0.305: v118.11,17.78 118.11,65.41 120.65,67.94 IC21.1
  Bottom 0.305: CTRL.C30 146.69,18.41 118.75,18.41 v118.11,17.78
!RPC  (via drill 0.6)
  Top 0.305: IC11.19 52.07,57.78 53.34,56.52 53.34,52.07 52.7,51.44 | 52.7,51.44 50.16,51.44 49.53,52.07 IC11.1 | 52.7,51.44 52.07,50.8 IC12.19 52.07,43.18 v50.8,41.91 49.53,40.64 IC12.1 | v139.7,41.91 140.97,40.64 v140.97,34.29
  Bottom 0.305: v50.8,41.91 51.44,41.27 69.22,41.27 70.48,42.55 72.39,42.55 73.66,41.27 104.14,41.27 105.41,42.55 107.31,42.55 109.22,40.64 123.83,40.64 125.09,41.91 v139.7,41.91 | v140.97,34.29 151.13,34.29 CTRL.B22
!TOGGLE_L  (via drill 0.6)
  Top 0.305: v104.14,27.94 104.14,48.9 106.68,51.44 v106.68,66.04 | v125.73,64.77 IC21.3 | IC16.12 100.33,24.13 v101.6,25.4
  Bottom 0.305: v101.6,25.4 v104.14,27.94 | v106.68,66.04 107.31,65.41 111.76,65.41 113.03,64.14 125.09,64.14 v125.73,64.77
!WAC  (via drill 0.6)
  Top 0.305: IC14.11 101.6,88.27 100.33,87 100.33,82.55 97.79,80.01 IC13.11 | IC16.11 102.87,17.78 104.14,19.05 v104.14,25.4 | IC15.11 96.52,56.52 v95.25,57.78 | v76.2,57.78 76.2,63.5 77.47,64.77 77.47,76.83 v76.83,77.47 | CTRL.A19 156.21,41.91 156.21,24.77 155.57,24.13 146.69,24.13 v145.41,25.4
  Bottom 0.305: IC15.11 96.52,26.67 99.06,24.13 102.87,24.13 v104.14,25.4 104.78,26.04 108.58,26.04 109.22,25.4 117.47,25.4 120.02,22.86 139.06,22.86 141.6,25.4 v145.41,25.4 | v95.25,57.78 94.61,58.42 76.83,58.42 v76.2,57.78 | v76.83,77.47 77.47,76.83 97.16,76.83 97.79,77.47 IC13.11
!WDR  (via drill 0.6)  (3 unrouted)
  Top 0.305: IC2.11 30.48,88.27 29.21,87 29.21,82.55 26.67,80.01 IC1.11 | v8.26,76.83 7.62,76.2 7.62,68.58 8.89,67.31 8.89,36.83 6.99,34.92 v6.99,33.02 | 31.75,17.78 33.02,19.05 v33.02,33.66 | v134.62,34.29 135.89,35.56 v135.89,39.37
  Bottom 0.305: v6.99,33.02 7.62,32.38 v25.4,32.38 26.67,33.66 v33.02,33.66 34.29,32.38 48.26,32.38 49.53,33.66 63.5,33.66 64.77,34.92 70.48,34.92 71.12,34.29 104.14,34.29 105.41,33.02 123.19,33.02 124.46,34.29 v134.62,34.29 | v135.89,39.37 153.67,39.37 CTRL.A21 | v8.26,76.83 26.04,76.83 26.67,77.47
!WPC  (via drill 0.6)
  Top 0.305: IC8.11 66.04,88.27 64.77,87 64.77,82.55 62.23,80.01 IC7.11 62.23,74.93 60.96,73.66 v60.96,67.94 | IC10.11 67.31,17.14 68.58,18.41 v68.58,22.23 v68.58,24.77 | v60.96,24.77 IC9.11 60.96,56.52 v60.33,57.15 | v144.15,24.13 144.15,27.94 v145.41,29.21 | v39.37,57.78 40.64,59.05 40.64,65.41 38.73,67.31 v38.73,67.94
  Bottom 0.305: v68.58,24.77 67.94,24.13 61.59,24.13 v60.96,24.77 | CTRL.A24 153.67,29.21 v145.41,29.21 | v68.58,22.23 69.22,22.86 74.93,22.86 76.83,24.77 92.08,24.77 93.34,23.5 97.16,23.5 97.79,22.86 104.78,22.86 105.41,23.5 116.84,23.5 118.75,21.59 141.6,21.59 v144.15,24.13 | v60.33,57.15 59.05,58.42 40.01,58.42 v39.37,57.78 | v60.96,67.94 60.33,67.31 38.73,67.31 v38.73,67.94
+12V
  Bottom 1.27: CTRL.C31 CTRL.B31 CTRL.A31
AC0  (via drill 0.6)  (1 unrouted)
  Top 0.305: IC17.3 90.17,56.52 88.9,57.78 88.9,64.77 90.17,66.04 IC13.3 | v112.39,87.63 111.12,86.36 111.12,52.7 v110.49,52.07
  Bottom 0.305: IC19.4 128.27,85.09 125.73,87.63 v112.39,87.63 | v110.49,52.07 109.86,51.44 90.81,51.44 90.17,52.07 IC17.3
AC1  (via drill 0.6)  (1 unrouted)
  Top 0.305: IC17.2 87.63,55.24 86.36,56.52 86.36,64.14 87.63,65.41 IC13.2 v87.63,74.93 | v112.39,74.93 v112.39,85.72
  Bottom 0.305: v112.39,74.93 111.76,74.3 102.23,74.3 100.97,75.56 94.61,75.56 93.34,74.3 88.27,74.3 v87.63,74.93 | v112.39,85.72 113.67,87 121.28,87 123.19,85.09 IC19.2
AC2  (via drill 0.6)  (1 unrouted)
  Top 0.305: IC17.6 97.79,57.15 96.52,58.42 96.52,63.5 97.79,64.77 v97.79,66.04 IC13.6 | IC19.6 133.35,81.92 134.62,80.64 v134.62,66.67
  Bottom 0.305: v134.62,66.67 131.44,63.5 112.39,63.5 111.12,64.77 106.05,64.77 104.14,66.67 101.6,66.67 100.97,66.04 v97.79,66.04
AC3  (via drill 0.6)  (1 unrouted)
  Top 0.305: IC17.7 100.33,56.52 v99.06,57.78 99.06,62.23 100.33,63.5 IC13.7 | IC19.8 138.43,81.92 139.7,80.64 139.7,58.42 v139.06,57.78
  Bottom 0.305: v139.06,57.78 138.43,57.15 99.69,57.15 v99.06,57.78
AC4  (via drill 0.6)  (1 unrouted)
  Top 0.305: IC17.5 95.25,55.24 93.98,56.52 IC14.3 93.98,87 95.25,88.27 v95.25,93.34
  Bottom 0.305: v95.25,93.34 97.16,95.25 107.95,95.25 108.58,94.61 136.53,94.61 138.43,92.71 IC19.13
AC5  (via drill 0.6)  (1 unrouted)
  Top 0.305: IC17.4 92.71,57.15 91.44,58.42 IC14.2 91.44,87 92.71,88.27 v92.71,93.34
  Bottom 0.305: v92.71,93.34 95.25,95.89 109.22,95.89 109.86,95.25 140.97,95.25 143.51,92.71 IC19.11
AC6  (via drill 0.6)  (1 unrouted)
  Top 0.305: IC17.8 102.87,57.15 101.6,58.42 IC14.6 101.6,86.36 102.87,87.63 v102.87,93.34
  Bottom 0.305: v102.87,93.34 104.14,94.61 106.68,94.61 107.31,93.98 132.08,93.98 133.35,92.71 IC19.15
AC7  (via drill 0.6)  (1 unrouted)
  Top 0.305: IC17.9 105.41,57.78 104.14,59.05 IC14.7 | v105.41,86.36 v105.41,93.34
  Bottom 0.305: v105.41,93.34 127.64,93.34 128.27,92.71 IC19.17 | IC14.7 104.14,85.09 v105.41,86.36
AC8  (via drill 0.6)
  Top 0.305: IC15.3 88.9,22.86 90.17,24.13 IC18.3 | v81.92,11.43 v81.92,20.32
  Bottom 0.305: v81.92,11.43 101.6,11.43 102.23,12.06 136.53,12.06 138.43,13.97 IC20.13 | v81.92,20.32 81.92,21.59 82.55,22.23 88.27,22.23 88.9,21.59 IC15.3
AC9  (via drill 0.6)
  Top 0.305: IC18.2 87.63,25.4 86.36,24.13 IC15.2 v86.36,9.53
  Bottom 0.305: v86.36,9.53 87.63,10.79 102.87,10.79 103.5,11.43 140.97,11.43 143.51,13.97 IC20.11
AC10  (via drill 0.6)
  Top 0.305: IC18.6 97.79,24.13 96.52,22.86 IC15.6 v96.52,13.34
  Bottom 0.305: v96.52,13.34 97.79,12.06 100.33,12.06 100.97,12.7 132.08,12.7 133.35,13.97 IC20.15
AC11  (via drill 0.6)
  Top 0.305: IC18.7 100.33,26.67 99.06,25.4 IC15.7 v99.06,13.34
  Bottom 0.305: v99.06,13.34 127.64,13.34 128.27,13.97 IC20.17
AC12
  Top 0.305: IC16.3 95.25,11.43 93.98,12.7 93.98,17.14 95.25,18.41 IC18.5
  Bottom 0.305: IC16.3 95.25,6.35 97.16,4.45 131.44,4.45 133.35,6.35 IC20.6
AC13
  Top 0.305: IC16.2 92.71,10.16 91.44,11.43 91.44,17.14 92.71,18.41 IC18.4
  Bottom 0.305: IC16.2 92.71,6.35 95.25,3.81 135.89,3.81 138.43,6.35 IC20.8
AC14
  Top 0.305: IC16.6 102.87,10.16 101.6,11.43 101.6,17.78 102.87,19.05 IC18.8
  Bottom 0.305: IC16.6 102.87,6.35 104.14,5.08 127,5.08 128.27,6.35 IC20.4
AC15  (via drill 0.6)
  Top 0.305: IC16.7 105.41,11.43 104.14,12.7 104.14,17.78 105.41,19.05 IC18.9 | IC20.2 123.19,10.79 124.46,12.06 v124.46,39.37
  Bottom 0.305: IC16.7 105.41,6.35 106.05,5.71 122.56,5.71 123.19,6.35 IC20.2 | v124.46,39.37 125.73,40.64 J1.P$1
DR0
  Top 0.305: IC1.3 19.05,66.04 17.78,64.77 17.78,58.42 19.05,57.15 IC5.3
DR1
  Top 0.305: IC1.2 16.51,65.41 15.24,64.14 15.24,57.15 16.51,55.88 IC5.2
DR2
  Top 0.305: IC1.6 26.67,65.41 25.4,64.14 25.4,58.42 26.67,57.15 IC5.6
DR3
  Top 0.305: IC1.7 29.21,64.14 27.94,62.87 27.94,57.15 29.21,55.88 IC5.7
DR4
  Top 0.305: IC5.5 24.13,56.52 22.86,57.78 IC2.3
DR5
  Top 0.305: IC5.4 21.59,55.88 20.32,57.15 IC2.2
DR6
  Top 0.305: IC5.8 31.75,56.52 30.48,57.78 IC2.6
DR7
  Top 0.305: IC5.9 34.29,57.15 33.02,58.42 IC2.7
DR8
  Top 0.305: IC3.3 17.78,22.86 19.05,24.13 IC6.3
DR9
  Top 0.305: IC3.2 15.24,24.13 16.51,25.4 IC6.2
DR10
  Top 0.305: IC3.6 25.4,24.13 26.67,25.4 IC6.6
DR11
  Top 0.305: IC6.7 29.21,24.13 27.94,22.86 IC3.7
DR12
  Top 0.305: IC4.3 24.13,11.43 22.86,12.7 22.86,17.14 24.13,18.41 IC6.5
DR13
  Top 0.305: IC4.2 21.59,10.16 20.32,11.43 20.32,17.14 21.59,18.41 IC6.4
DR14
  Top 0.305: IC6.8 31.75,19.05 30.48,17.78 30.48,11.43 31.75,10.16 IC4.6
DR15
  Top 0.305: IC4.7 34.29,11.43 33.02,12.7 33.02,17.78 34.29,19.05 IC6.9
FNEG
  Bottom 0.305: J1.P$2 CTRL.C20
FZERO  (via drill 0.6)
  Top 0.305: IC21.10 130.81,74.93 129.54,73.66 129.54,65.41 130.81,64.14 R4.1 130.81,57.15 132.08,55.88 132.08,44.45 v132.72,43.81
  Bottom 0.305: CTRL.C19 133.35,43.18 v132.72,43.81
GND  (via drill 0.6)
  Top 1.27: C11.1 43.18,30.48 44.45,31.75 v44.45,38.1 C10.1 v44.45,53.34 C9.1 C8.1 v44.45,83.82 44.45,87.63 C7.1 | C17.1 78.74,30.48 80.01,31.75 v80.01,38.1 C16.1 v80.01,53.34 C15.1 C14.1 v80.01,83.82 80.01,87.63 C13.1 | C20.1 v115.57,22.23 v115.57,38.1 v115.57,53.34 v115.57,71.12 C21.1 v115.57,83.82 | v43.18,7.62 v43.18,15.24 | v138.43,70.48 v138.43,78.11 | v78.74,7.62 v78.74,15.24 v78.74,20.32 | IC19.3 IC19.18
  other vias: 48.26,91.44
  pour Bottom (isolate 0.61, no thermals): 0,0 160.02,0 160.02,99.06 0,99.06
IBUS0  (via drill 0.6)
  Top 0.305: v40.01,81.28 39.37,81.28 36.83,78.74 36.83,67.94 39.37,65.41 v39.37,62.23
  Bottom 0.305: CTRL.C5 147.32,81.28 88.9,81.28 87.63,80.01 | 87.63,80.01 IC13.15 | 52.07,80.01 IC7.15 | 52.07,80.01 53.34,81.28 86.36,81.28 87.63,80.01 | IC1.15 16.51,80.01 17.14,80.64 39.37,80.64 v40.01,81.28 50.8,81.28 52.07,80.01 | IC5.17 21.59,62.23 22.23,62.87 38.73,62.87 v39.37,62.23 40.01,62.87 56.52,62.87 57.15,62.23 | 57.15,62.23 IC11.17 | IC17.17 92.71,62.23 92.08,62.87 57.78,62.87 57.15,62.23
IBUS1  (via drill 0.6)
  Top 0.305: v85.09,73.66 IC13.1 v85.09,64.14 | v90.17,64.14 IC17.18 | v54.61,64.14 IC11.18 | v142.88,72.39 v142.88,76.2
  Bottom 0.305: v142.88,72.39 142.24,73.03 85.72,73.03 v85.09,73.66 75.56,73.66 74.93,73.03 50.16,73.03 49.53,72.39 | IC1.1 13.97,72.39 16.51,74.93 47.62,74.93 49.53,73.03 49.53,72.39 | IC5.18 19.05,62.87 19.68,63.5 53.98,63.5 v54.61,64.14 55.24,63.5 84.45,63.5 v85.09,64.14 v90.17,64.14 | v142.88,76.2 CTRL.C6 | 49.53,72.39 IC7.1
IBUS2  (via drill 0.6)
  Top 0.305: v64.77,74.3 IC7.10 | v100.33,74.3 IC13.10 | v73.66,59.05 v73.66,74.3
  Bottom 0.305: CTRL.C7 100.97,73.66 v100.33,74.3 99.69,73.66 87,73.66 85.72,74.93 74.3,74.93 v73.66,74.3 v64.77,74.3 50.16,74.3 48.9,75.56 31.11,75.56 29.21,77.47 IC1.10 | IC5.14 29.21,59.69 29.84,59.05 64.14,59.05 64.77,59.69 | 64.77,59.69 IC11.14 | 64.77,59.69 65.41,59.05 v73.66,59.05 99.69,59.05 100.33,59.69 IC17.14
IBUS3  (via drill 0.6)
  Top 0.305: v102.87,64.14 IC17.13 | v67.31,64.77 IC11.13 | IC5.13 v31.75,64.77 | v140.97,76.2 v140.97,71.12 | v102.87,75.56 IC13.9 | v67.31,75.56 IC7.9 | v72.39,64.77 v72.39,76.2
  Bottom 0.305: v102.87,64.14 102.23,63.5 92.71,63.5 90.81,65.41 83.82,65.41 83.19,64.77 v72.39,64.77 v67.31,64.77 66.67,64.77 66.04,64.14 56.52,64.14 55.24,65.41 41.27,65.41 40.01,64.14 32.38,64.14 v31.75,64.77 | v140.97,76.2 103.5,76.2 v102.87,75.56 102.23,76.2 v72.39,76.2 67.94,76.2 v67.31,75.56 63.5,75.56 62.87,74.93 51.44,74.93 50.16,76.2 33.02,76.2 31.75,77.47 IC1.9 | v140.97,71.12 CTRL.C8
IBUS4  (via drill 0.6)
  Top 0.305: IC5.15 26.67,63.5 v27.94,64.77 | v63.5,65.41 62.23,64.14 IC11.15 | v99.06,64.77 99.06,64.14 97.79,62.87 IC17.15 | v38.1,93.34 38.1,82.55 35.56,80.01 35.56,66.04 v36.2,65.41
  Bottom 0.305: IC2.15 20.32,92.71 20.95,93.34 v38.1,93.34 55.24,93.34 55.88,92.71 | 55.88,92.71 IC8.15 | 55.88,92.71 56.52,93.34 90.81,93.34 91.44,92.71 IC14.15 | v27.94,64.77 29.21,66.04 32.38,66.04 33.02,65.41 v36.2,65.41 36.83,66.04 56.52,66.04 57.78,64.77 62.87,64.77 v63.5,65.41 64.14,66.04 73.03,66.04 73.66,65.41 82.55,65.41 83.19,66.04 91.44,66.04 92.71,64.77 v99.06,64.77 100.97,64.77 101.6,65.41 104.14,65.41 105.41,64.14 110.49,64.14 111.76,62.87 132.08,62.87 133.99,64.77 138.43,64.77 142.24,68.58 CTRL.C9
IBUS5  (via drill 0.6)
  Top 0.305: IC11.16 59.69,64.77 v60.96,66.04 | v95.25,66.04 IC17.16 | IC5.16 v24.13,64.77 | v53.34,87.63 IC8.1 | v87.63,87.63 88.9,86.36 IC14.1 | v74.93,66.67 74.93,75.56 74.3,76.2 73.03,77.47 73.03,86.36 v74.3,87.63
  Bottom 0.305: IC17.16 95.25,62.23 95.89,62.87 104.14,62.87 104.78,63.5 109.86,63.5 111.12,62.23 139.7,62.23 140.97,63.5 143.51,66.04 CTRL.C10 | v24.13,64.77 26.04,66.67 60.33,66.67 v60.96,66.04 61.59,66.67 v74.93,66.67 75.56,66.04 81.92,66.04 82.55,66.67 92.08,66.67 92.71,66.04 v95.25,66.04 | IC2.1 17.78,85.09 19.68,87 34.92,87 35.56,86.36 36.83,86.36 38.73,88.27 52.7,88.27 v53.34,87.63 53.98,88.27 69.85,88.27 71.12,87 73.66,87 v74.3,87.63 74.93,88.27 87,88.27 v87.63,87.63
IBUS6  (via drill 0.6)
  Top 0.305: IC11.12 69.85,87 68.58,88.27 IC8.10 68.58,92.71 v66.67,94.61 | IC5.12 34.29,87 33.02,88.27 IC2.10 33.02,93.34 v34.29,94.61 | IC14.10 104.14,86.36 105.41,85.09 IC17.12 | v91.44,94.61 96.52,94.61 v97.79,93.34
  Bottom 0.305: v34.29,94.61 40.01,94.61 40.64,93.98 66.04,93.98 v66.67,94.61 v91.44,94.61 | v97.79,93.34 97.79,90.17 98.42,89.53 103.5,89.53 104.14,90.17 IC14.10 | CTRL.C11 142.88,63.5 142.24,62.87 140.97,61.59 110.49,61.59 109.22,62.87 106.05,62.87 105.41,62.23 IC17.12
IBUS7  (via drill 0.6)
  Top 0.305: IC5.11 36.83,62.23 34.92,64.14 34.92,80.64 36.83,82.55 36.83,87 v36.2,87.63 35.56,88.27 IC2.9 | IC8.9 71.12,88.9 v71.75,88.27 72.39,87.63 72.39,80.01 71.12,78.74 71.12,64.14 72.39,62.87 IC11.11 | IC14.9 106.68,88.27 v107.31,87.63 107.95,87 107.95,81.28 106.68,80.01 106.68,67.94 107.95,66.67 IC17.11
  Bottom 0.305: IC17.11 CTRL.C12 | v36.2,87.63 37.47,88.9 71.12,88.9 v71.75,88.27 | v71.75,88.27 72.39,87.63 | v71.75,88.27 72.39,88.9 88.27,88.9 88.9,88.27 106.68,88.27 v107.31,87.63
IBUS8  (via drill 0.6)
  Top 0.305: v73.66,29.84 73.66,34.29 74.93,35.56 74.93,46.35 v74.3,46.99 | v138.43,29.84 v138.43,38.1
  Bottom 0.305: IC3.15 15.24,29.21 15.88,29.84 50.16,29.84 50.8,29.21 | 50.8,29.21 IC9.15 | 86.36,29.21 IC15.15 | 50.8,29.21 51.44,29.84 v73.66,29.84 74.3,30.48 82.55,30.48 83.19,29.84 85.72,29.84 86.36,29.21 | 57.15,46.99 56.52,47.62 22.23,47.62 21.59,46.99 IC6.17 | 57.15,46.99 IC12.17 | IC18.17 92.71,46.99 92.08,47.62 74.93,47.62 v74.3,46.99 73.66,47.62 57.78,47.62 57.15,46.99 | v138.43,29.84 87,29.84 86.36,29.21 | v138.43,38.1 CTRL.C21
IBUS9  (via drill 0.6)
  Top 0.305: IC3.1 12.7,23.5 13.97,24.77 13.97,29.84 v15.24,31.11 15.24,40.01 19.05,43.81 IC6.18 | IC9.1 48.26,23.5 49.53,24.77 49.53,31.75 v50.16,32.38 50.8,33.02 50.8,40.01 54.61,43.81 IC12.18 | IC15.1 83.82,24.13 85.09,25.4 v85.09,32.38 86.36,33.66 86.36,40.01 90.17,43.81 IC18.18
  Bottom 0.305: CTRL.C22 139.06,35.56 135.25,31.75 104.14,31.75 102.87,33.02 98.42,33.02 97.79,32.38 v85.09,32.38 69.22,32.38 68.58,33.02 50.8,33.02 v50.16,32.38 49.53,31.75 33.02,31.75 31.75,33.02 27.94,33.02 26.04,31.11 v15.24,31.11
IBUS10  (via drill 0.6)
  Top 0.305: IC12.14 64.77,43.18 63.5,41.91 v63.5,31.75 IC9.10 | IC6.14 29.21,43.18 27.94,41.91 v27.94,31.11 IC3.10 | IC18.14 100.33,43.18 99.06,41.91 v99.06,31.75 IC15.10
  Bottom 0.305: CTRL.C23 137.79,33.02 135.89,31.11 103.5,31.11 102.23,32.38 99.69,32.38 v99.06,31.75 98.42,31.11 84.45,31.11 83.82,31.75 67.94,31.75 67.31,32.38 64.14,32.38 v63.5,31.75 62.87,31.11 32.38,31.11 31.11,32.38 29.21,32.38 v27.94,31.11
IBUS11  (via drill 0.6)
  Top 0.305: IC3.9 v30.48,31.11 30.48,40.64 31.75,41.91 IC6.13 | IC9.9 v66.04,31.11 66.04,40.64 67.31,41.91 IC12.13 | IC15.9 v101.6,31.11 101.6,40.64 102.87,41.91 IC18.13
  Bottom 0.305: v30.48,31.11 31.11,30.48 65.41,30.48 v66.04,31.11 83.19,31.11 83.82,30.48 100.97,30.48 v101.6,31.11 102.23,30.48 136.53,30.48 137.16,31.11 139.7,31.11 140.34,30.48 CTRL.C24
IBUS12  (via drill 0.6)
  Top 0.305: v111.76,46.99 111.76,34.92 110.49,33.66 110.49,24.77 v113.03,22.23 | v39.37,13.34 39.37,15.88 38.1,17.14 38.1,33.66 39.37,34.92 v39.37,43.81
  Bottom 0.305: IC6.15 26.67,44.45 27.3,43.81 v39.37,43.81 61.59,43.81 62.23,44.45 | 62.23,44.45 IC12.15 | 62.23,44.45 62.87,43.81 96.52,43.81 97.79,45.09 IC18.15 97.79,46.99 98.42,47.62 108.58,47.62 109.22,46.99 v111.76,46.99 | IC4.15 21.59,13.97 22.23,13.34 v39.37,13.34 56.52,13.34 57.15,13.97 | 57.15,13.97 IC10.15 | 57.15,13.97 57.78,13.34 92.08,13.34 92.71,13.97 IC16.15 | CTRL.C25 142.88,20.95 114.3,20.95 v113.03,22.23
IBUS13  (via drill 0.6)
  Top 0.305: IC6.16 24.13,48.26 v24.77,48.9 | v59.69,48.9 IC12.16 | v110.49,48.26 110.49,35.56 109.22,34.29 109.22,24.13 v111.12,22.23 | v40.64,48.9 40.64,46.99 41.91,45.72 41.91,33.66 40.64,32.38 40.64,24.77 39.37,23.5 39.37,18.41 40.64,17.14 40.64,12.7 40.01,12.06 v40.01,5.71
  Bottom 0.305: CTRL.C26 144.78,20.32 113.03,20.32 v111.12,22.23 | IC4.1 19.05,6.35 19.68,5.71 v40.01,5.71 53.98,5.71 54.61,6.35 | 54.61,6.35 IC10.1 | 54.61,6.35 55.24,5.71 89.53,5.71 90.17,6.35 IC16.1 | v24.77,48.9 25.4,48.26 40.01,48.26 v40.64,48.9 41.27,48.26 59.05,48.26 v59.69,48.9 60.33,48.26 93.98,48.26 95.25,46.99 | 95.25,46.99 IC18.16 | v110.49,48.26 96.52,48.26 95.25,46.99
IBUS14  (via drill 0.6)
  Top 0.305: IC6.12 34.29,42.55 v35.56,41.27 35.56,19.05 34.29,17.78 IC4.10 | IC12.12 69.85,42.55 v71.12,41.27 71.12,18.41 69.85,17.14 IC10.10 | IC18.12 105.41,42.55 v106.68,41.27 v106.68,22.23 106.68,18.41 105.41,17.14 IC16.10
  Bottom 0.305: CTRL.C27 146.69,19.68 111.76,19.68 109.22,22.23 v106.68,22.23 | v35.56,41.27 36.2,40.64 70.48,40.64 v71.12,41.27 71.75,40.64 106.05,40.64 v106.68,41.27
IBUS15  (via drill 0.6)
  Top 0.305: IC6.11 36.83,42.55 38.1,41.27 38.1,35.56 36.83,34.29 v36.83,18.41 IC4.9 | IC12.11 72.39,42.55 73.66,41.27 73.66,35.56 72.39,34.29 v72.39,18.41 IC10.9 | IC18.11 107.95,42.55 109.22,41.27 109.22,36.2 107.95,34.92 v107.95,20.32 IC16.9
  Bottom 0.305: v36.83,18.41 v72.39,18.41 94.61,18.41 95.89,17.14 107.31,17.14 107.95,16.51 IC16.9 | CTRL.C28 148.59,19.05 111.12,19.05 109.86,20.32 v107.95,20.32
N$1
  Top 0.305: R2.1 127,64.14 128.27,65.41 IC21.4
  Bottom 0.305: IC21.4 128.27,71.75 128.91,72.39 130.18,72.39 130.81,71.75 IC21.5
N$2
  Top 0.305: IC19.19 123.19,88.27 121.92,87 121.92,60.96 120.65,59.69 120.65,46.99 121.92,45.72 121.92,12.06 120.65,10.79 IC20.1
N$16
  Top 0.305: IC20.19 123.19,46.35 121.92,47.62 121.92,56.52 124.46,59.05 124.46,79.38 125.09,80.01 127.64,80.01 128.27,79.38 IC21.11
N$25
  Top 0.305: IC2.5 27.94,85.09 27.3,85.72 24.77,85.72 24.13,85.09 IC1.12
N$26
  Top 0.305: IC13.12 95.25,85.09 95.89,85.72 98.42,85.72 99.06,85.09 IC14.5
N$27  (via drill 0.6)
  Top 0.305: v74.93,24.77 74.93,27.3 76.2,28.57 76.2,34.29 77.47,35.56 77.47,48.26 76.2,49.53 76.2,55.24 77.47,56.52 77.47,62.87 78.74,64.14 78.74,77.47 76.2,80.01 76.2,94.61 v77.47,95.89 | v90.17,95.89 97.16,95.89 99.06,93.98 IC14.12 | v93.98,24.77 IC15.5
  Bottom 0.305: v93.98,24.77 93.34,25.4 75.56,25.4 v74.93,24.77 | v77.47,95.89 v90.17,95.89
N$28
  Top 0.305: IC7.12 59.69,85.09 60.33,85.72 62.87,85.72 63.5,85.09 IC8.5
N$29  (via drill 0.6)
  Top 0.305: v22.86,25.4 IC3.5 | v8.89,93.98 6.99,92.08 6.99,67.94 8.26,66.67 8.26,38.1 5.71,35.56 v5.71,31.75 | v27.3,94.61 27.94,93.98 IC2.12
  Bottom 0.305: v22.86,25.4 15.24,25.4 13.97,26.67 13.97,29.84 12.7,31.11 6.35,31.11 v5.71,31.75 | v8.89,93.98 26.67,93.98 v27.3,94.61
N$30  (via drill 0.6)
  Top 0.305: v58.42,24.77 IC9.5 | v39.37,26.04 39.37,33.02 40.64,34.29 40.64,45.09 38.1,47.62 38.1,65.41 36.2,67.31 36.2,79.38 39.37,82.55 39.37,93.34 v41.27,95.25 | IC8.12 63.5,94.61 v62.87,95.25
  Bottom 0.305: v58.42,24.77 57.78,25.4 40.01,25.4 v39.37,26.04 | v41.27,95.25 41.91,94.61 62.23,94.61 v62.87,95.25
N$31  (via drill 0.6)
  Top 0.305: v22.86,33.66 IC3.12 | v8.26,34.29 8.26,32.38 5.71,29.84 5.71,19.05 v13.34,11.43 | v29.21,10.79 IC4.5
  Bottom 0.305: v22.86,33.66 8.89,33.66 v8.26,34.29 | v13.34,11.43 28.57,11.43 v29.21,10.79
N$39  (via drill 0.6)
  Top 0.305: v66.04,25.4 66.04,23.5 64.77,22.23 64.77,18.41 63.5,17.14 63.5,11.43 64.77,10.16 IC10.5
  Bottom 0.305: IC9.12 58.42,26.67 59.05,26.04 65.41,26.04 v66.04,25.4
N$77  (via drill 0.6)
  Top 0.305: IC15.12 93.98,41.91 v94.61,42.55 | v113.03,41.91 113.03,34.29 111.76,33.02 111.76,25.4 114.3,22.86 114.3,7.62 112.39,5.71 100.97,5.71 100.33,6.35 IC16.5
  Bottom 0.305: v94.61,42.55 103.5,42.55 104.14,43.18 111.76,43.18 v113.03,41.91
PC0
  Top 0.305: IC11.3 54.61,57.15 53.34,58.42 53.34,64.77 54.61,66.04 IC7.3
PC1
  Top 0.305: IC11.2 52.07,55.88 50.8,57.15 50.8,64.14 52.07,65.41 IC7.2
PC2
  Top 0.305: IC11.6 62.23,57.15 60.96,58.42 60.96,64.14 62.23,65.41 IC7.6
PC3
  Top 0.305: IC11.7 64.77,58.42 63.5,59.69 63.5,62.87 64.77,64.14 IC7.7
PC4
  Top 0.305: IC11.5 59.69,55.88 58.42,57.15 IC8.3
PC5
  Top 0.305: IC11.4 57.15,56.52 55.88,57.78 IC8.2
PC6
  Top 0.305: IC11.8 67.31,58.42 66.04,59.69 IC8.6
PC7
  Top 0.305: IC8.7 68.58,59.69 69.85,58.42 IC11.9
PC8
  Top 0.305: IC12.3 54.61,24.13 53.34,22.86 IC9.3
PC9
  Top 0.305: IC12.2 52.07,25.4 50.8,24.13 IC9.2
PC10  (via drill 0.6)
  Top 0.305: IC9.6 60.96,22.86 62.23,24.13 IC12.6 62.23,42.55 63.5,43.81 v63.5,56.52
  Bottom 0.305: CTRL.B12 151.13,59.69 144.15,59.69 140.97,56.52 68.58,56.52 67.31,57.78 64.77,57.78 v63.5,56.52
PC11  (via drill 0.6)
  Top 0.305: IC9.7 63.5,22.86 64.77,24.13 IC12.7 64.77,41.27 66.04,42.55 v66.04,56.52
  Bottom 0.305: CTRL.B13 151.13,57.15 148.59,57.15 147.32,55.88 67.31,55.88 66.67,56.52 v66.04,56.52
PC12  (via drill 0.6)
  Top 0.305: IC10.3 59.69,11.43 58.42,12.7 58.42,17.14 59.69,18.41 IC12.5 59.69,41.27 v58.42,42.55 | v55.24,42.55 55.88,43.18 v55.88,55.24
  Bottom 0.305: CTRL.B14 151.13,54.61 135.25,54.61 134.62,55.24 v55.88,55.24 | v58.42,42.55 57.78,41.91 55.88,41.91 v55.24,42.55
PC13  (via drill 0.6)
  Top 0.305: IC10.2 57.15,10.16 55.88,11.43 55.88,17.14 57.15,18.41 IC12.4 57.15,43.18 58.42,44.45 v58.42,51.44
  Bottom 0.305: CTRL.B15 151.13,52.07 138.43,52.07 136.53,50.16 70.48,50.16 69.22,51.44 v58.42,51.44
PC14  (via drill 0.6)
  Top 0.305: IC10.6 67.31,10.79 66.04,12.06 66.04,17.14 67.31,18.41 IC12.8 67.31,40.01 68.58,41.27 v68.58,49.53
  Bottom 0.305: CTRL.B16 151.13,49.53 v68.58,49.53
PC15  (via drill 0.6)
  Top 0.305: IC12.9 v69.85,33.66 69.85,18.41 68.58,17.14 68.58,12.7 69.85,11.43 IC10.7 | v125.73,33.02 v125.73,46.99
  Bottom 0.305: CTRL.B17 151.13,46.99 v125.73,46.99 | v125.73,33.02 125.09,32.38 104.78,32.38 103.5,33.66 84.45,33.66 83.82,33.02 70.48,33.02 v69.85,33.66
RESERVED_POWER
  Bottom 1.27: CTRL.C4 CTRL.B4 CTRL.A4
RESET  (via drill 0.6)
  Top 0.305: IC2.14 22.86,89.53 19.05,85.72 IC1.14 | IC7.14 54.61,85.72 58.42,89.53 IC8.14 | IC21.2 R1.1 | v109.86,87 108.58,85.72 108.58,80.64 107.31,79.38 107.31,74.3 v109.86,71.75 | v90.17,89.53 IC13.14 | v16.51,18.41 16.51,23.5 17.78,24.77 IC3.14 | IC9.14 53.34,24.77 52.07,23.5 v52.07,17.14 | IC15.14 88.9,24.77 87.63,23.5 v87.63,17.14 | v74.3,17.14 73.66,17.78 73.66,27.3 74.93,28.57 74.93,34.29 76.2,35.56 76.2,46.99 74.93,48.26 74.93,64.14 76.2,65.41 76.2,76.2 75.56,76.83 75.56,88.9 v74.3,90.17
  Bottom 0.305: IC4.14 24.13,16.51 24.77,17.14 | 24.77,17.14 v52.07,17.14 59.05,17.14 59.69,16.51 | 59.69,16.51 IC10.14 | 59.69,16.51 60.33,17.14 v74.3,17.14 v87.63,17.14 94.61,17.14 95.25,16.51 IC16.14 | IC21.2 123.19,69.22 121.92,67.94 119.38,67.94 118.11,69.22 114.3,69.22 111.76,71.75 v109.86,71.75 | IC2.14 22.86,90.17 23.5,89.53 57.78,89.53 58.42,90.17 | 58.42,89.53 IC8.14 58.42,90.17 | 58.42,90.17 59.05,89.53 73.66,89.53 v74.3,90.17 74.93,89.53 v90.17,89.53 93.34,89.53 93.98,90.17 | 93.98,90.17 IC14.14 | 93.98,90.17 95.25,88.9 107.95,88.9 v109.86,87 | 24.77,17.14 24.13,17.78 17.14,17.78 v16.51,18.41
VCC
  pour Top (isolate 0.61, no thermals): 0,0 160.02,0 160.02,100.33 0,100.33

### Text on the board
Top: (c) 2011 AlexiosC
Bottom: (c) 2011 AlexiosC
tNames: Zero Flag LSB | LSB | http://www.bedroomlan.org/cft | (c) 2011 AlexiosC | CFT CONTROL BUS | 1 | 0 | 5 | 4 | 2 | 3 | 6 | 7 | 1 | 0 | 5 | 4 | 2 | 3 | 6 | 7 | 1 | 0 | 5 | 4 | 2 | 3 | 6 | 7 | DR | PC | AC | 9 | 8 | D | C | A | B | E | F | 9 | 8 | D | C | A | B | E | F | 9 | 8 | D | C | A | B | E | F | MSB | Zero Flag MSB | CFT Major Register File (AC, PC, DR) Rev C